# EAGLE design controller (EAGLE 4.16)
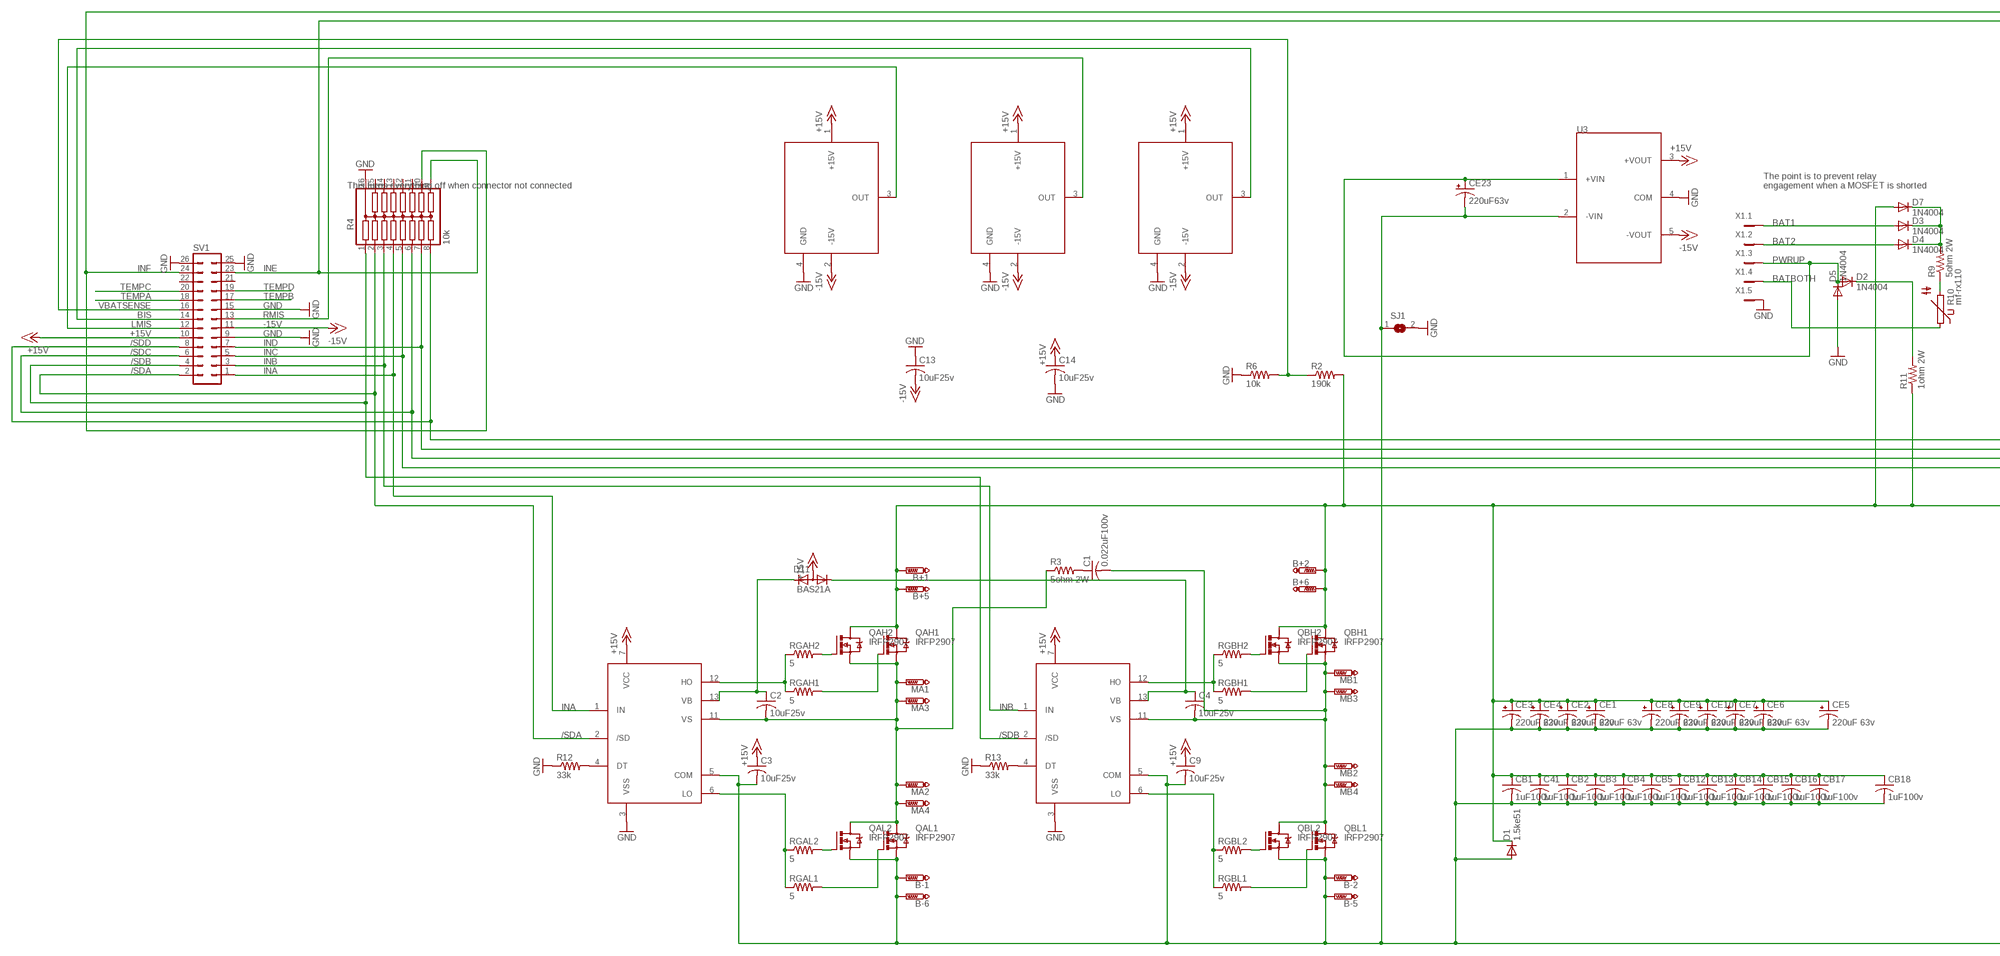
[diagram p0: schematic, sheet 1, part 1 of 3]
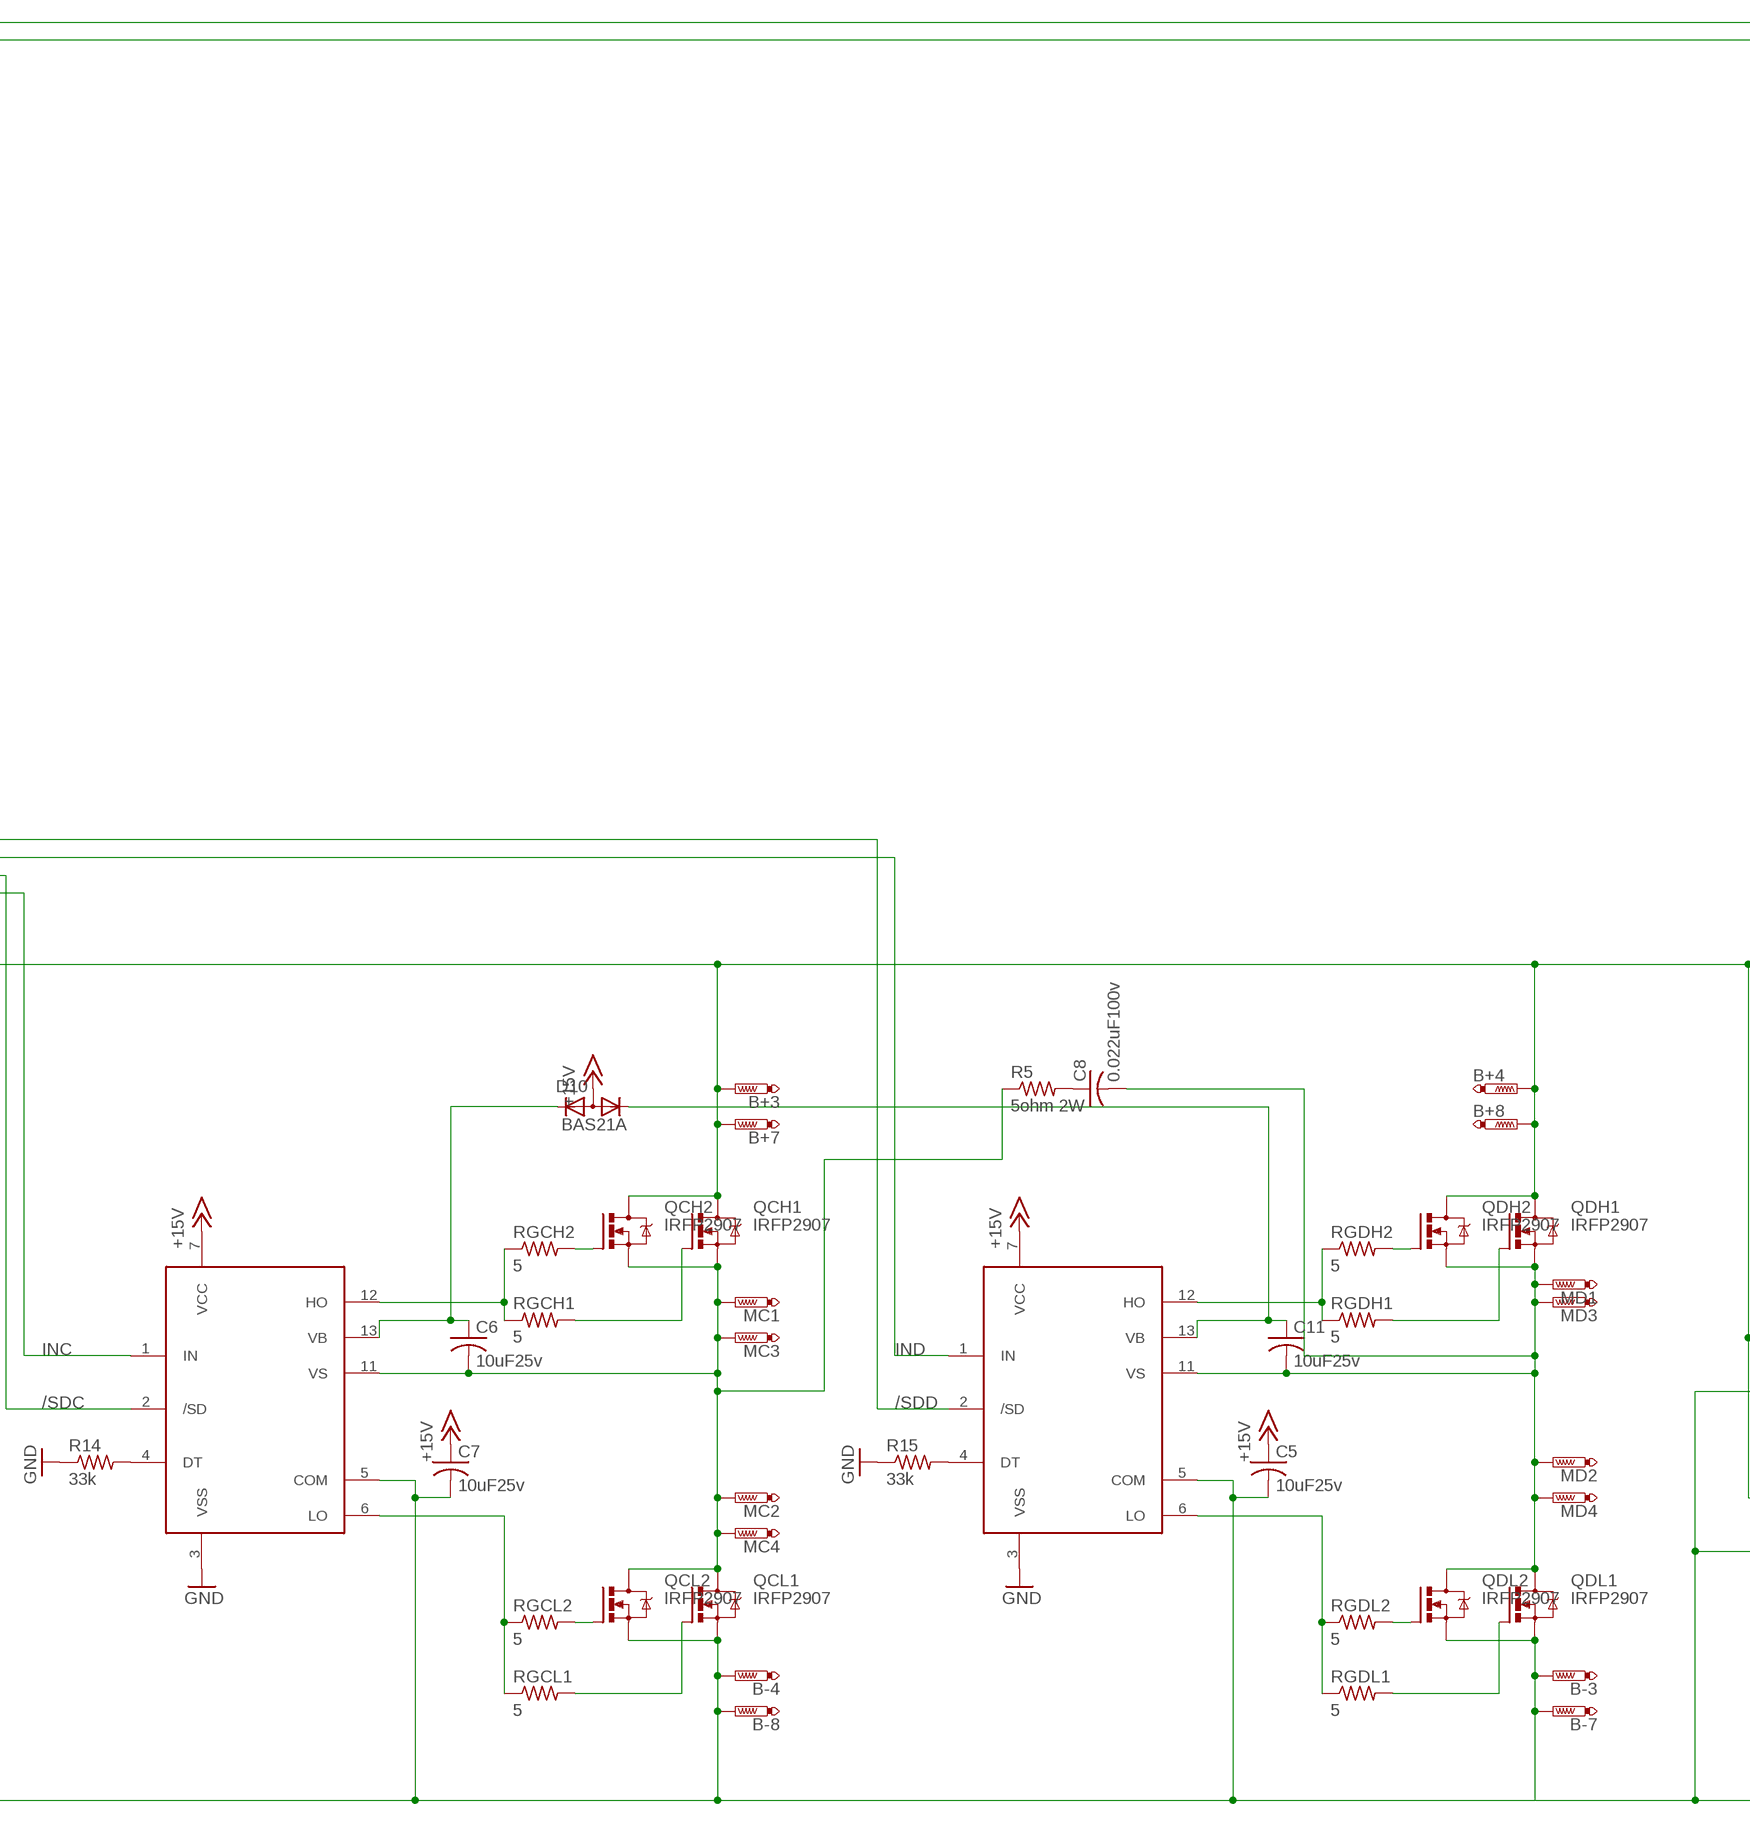
[diagram p1: schematic, sheet 1, part 2 of 3]
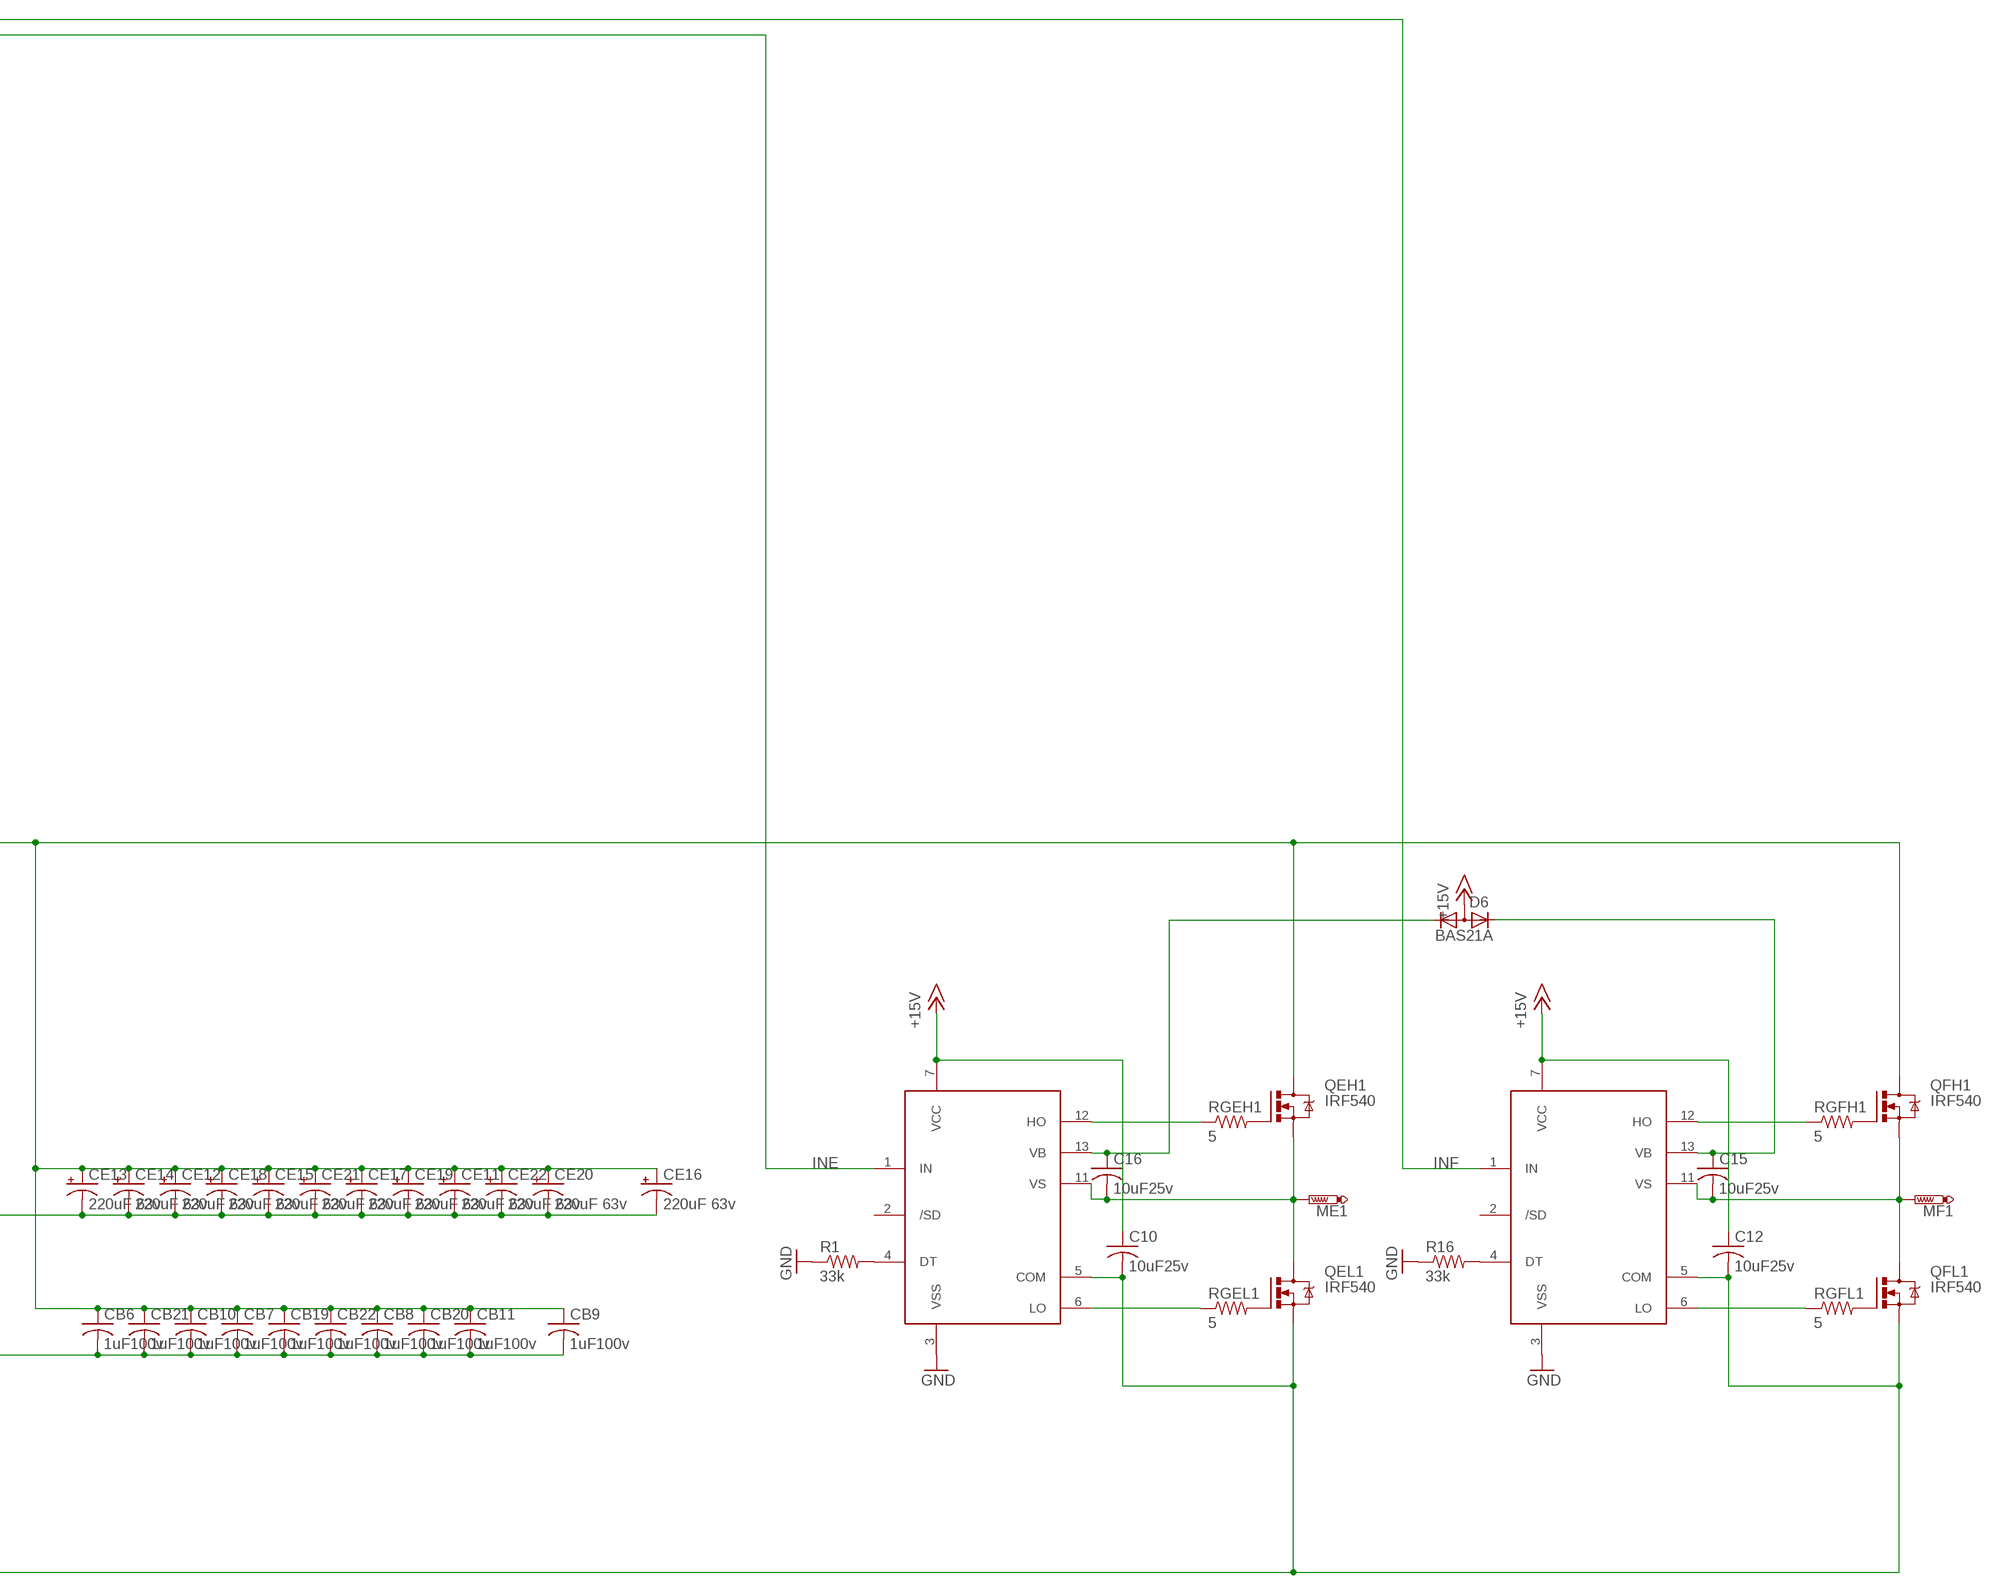
[diagram p2: schematic, sheet 1, part 3 of 3]

## Parts
B+1  PTR1PAD1-17Y  [P1-17Y]
B+2  PTR1PAD1-17Y  [P1-17Y]
B+3  PTR1PAD1-17Y  [P1-17Y]
B+4  PTR1PAD1-17Y  [P1-17Y]
B+5  PTR1PAD1-17Y  [P1-17Y]
B+6  PTR1PAD1-17Y  [P1-17Y]
B+7  PTR1PAD1-17Y  [P1-17Y]
B+8  PTR1PAD1-17Y  [P1-17Y]
B-1  PTR1PAD1-17Y  [P1-17Y]
B-2  PTR1PAD1-17Y  [P1-17Y]
B-3  PTR1PAD1-17Y  [P1-17Y]
B-4  PTR1PAD1-17Y  [P1-17Y]
B-5  PTR1PAD1-17Y  [P1-17Y]
B-6  PTR1PAD1-17Y  [P1-17Y]
B-7  PTR1PAD1-17Y  [P1-17Y]
B-8  PTR1PAD1-17Y  [P1-17Y]
BATIS  L08P150D15  [L08P]
C1  0.022uF100v  C-US102-043X133  [C102-043X133]
C2  10uF25v  C-USC1206  [C1206]
C3  10uF25v  C-USC1206  [C1206]
C4  10uF25v  C-USC1206  [C1206]
C5  10uF25v  C-USC1206  [C1206]
C6  10uF25v  C-USC1206  [C1206]
C7  10uF25v  C-USC1206  [C1206]
C8  0.022uF100v  C-US102-043X133  [C102-043X133]
C9  10uF25v  C-USC1206  [C1206]
C10  10uF25v  C-USC1206  [C1206]
C11  10uF25v  C-USC1206  [C1206]
C12  10uF25v  C-USC1206  [C1206]
C13  10uF25v  C-USC1206  [C1206]
C14  10uF25v  C-USC1206  [C1206]
C15  10uF25v  C-USC1206  [C1206]
C16  10uF25v  C-USC1206  [C1206]
C41  1uF100v  C-USC1812  [C1812]
CB1  1uF100v  C-USC1812  [C1812]
CB2  1uF100v  C-USC1812  [C1812]
CB3  1uF100v  C-USC1812  [C1812]
CB4  1uF100v  C-USC1812  [C1812]
CB5  1uF100v  C-USC1812  [C1812]
CB6  1uF100v  C-USC1812  [C1812]
CB7  1uF100v  C-USC1812  [C1812]
CB8  1uF100v  C-USC1812  [C1812]
CB9  1uF100v  C-USC1812  [C1812]
CB10  1uF100v  C-USC1812  [C1812]
CB11  1uF100v  C-USC1812  [C1812]
CB12  1uF100v  C-USC1812  [C1812]
CB13  1uF100v  C-USC1812  [C1812]
CB14  1uF100v  C-USC1812  [C1812]
CB15  1uF100v  C-USC1812  [C1812]
CB16  1uF100v  C-USC1812  [C1812]
CB17  1uF100v  C-USC1812  [C1812]
CB18  1uF100v  C-USC1812  [C1812]
CB19  1uF100v  C-USC1812  [C1812]
CB20  1uF100v  C-USC1812  [C1812]
CB21  1uF100v  C-USC1812  [C1812]
CB22  1uF100v  C-USC1812  [C1812]
CE1  220uF 63v  CPOL-USE5-10.5  [E5-10,5]
CE2  220uF 63v  CPOL-USE5-10.5  [E5-10,5]
CE3  220uF 63v  CPOL-USE5-10.5  [E5-10,5]
CE4  220uF 63v  CPOL-USE5-10.5  [E5-10,5]
CE5  220uF 63v  CPOL-USE5-10.5  [E5-10,5]
CE6  220uF 63v  CPOL-USE5-10.5  [E5-10,5]
CE7  220uF 63v  CPOL-USE5-10.5  [E5-10,5]
CE8  220uF 63v  CPOL-USE5-10.5  [E5-10,5]
CE9  220uF 63v  CPOL-USE5-10.5  [E5-10,5]
CE10  220uF 63v  CPOL-USE5-10.5  [E5-10,5]
CE11  220uF 63v  CPOL-USE5-10.5  [E5-10,5]
CE12  220uF 63v  CPOL-USE5-10.5  [E5-10,5]
CE13  220uF 63v  CPOL-USE5-10.5  [E5-10,5]
CE14  220uF 63v  CPOL-USE5-10.5  [E5-10,5]
CE15  220uF 63v  CPOL-USE5-10.5  [E5-10,5]
CE16  220uF 63v  CPOL-USE5-10.5  [E5-10,5]
CE17  220uF 63v  CPOL-USE5-10.5  [E5-10,5]
CE18  220uF 63v  CPOL-USE5-10.5  [E5-10,5]
CE19  220uF 63v  CPOL-USE5-10.5  [E5-10,5]
CE20  220uF 63v  CPOL-USE5-10.5  [E5-10,5]
CE21  220uF 63v  CPOL-USE5-10.5  [E5-10,5]
CE22  220uF 63v  CPOL-USE5-10.5  [E5-10,5]
CE23  220uF63v  CPOL-USE5-10.5  [E5-10,5]
D1  1.5ke51  DIODE-DO201-15  [DO201-15]
D2  1N4004  DIODE-DO41-10  [DO41-10]
D3  1N4004  DIODE-DO41-10  [DO41-10]
D4  1N4004  DIODE-DO41-10  [DO41-10]
D5  1N4004  DIODE-DO41-10  [DO41-10]
D6  BAS21A  DIODE-2CA|ACSOT23  [SOT23]
D7  1N4004  DIODE-DO41-10  [DO41-10]
D10  BAS21A  DIODE-2CA|ACSOT23  [SOT23]
D11  BAS21A  DIODE-2CA|ACSOT23  [SOT23]
DRV1  IR21844S  [14-SOIC]
DRV2  IR21844S  [14-SOIC]
DRV3  IR21844S  [14-SOIC]
DRV4  IR21844S  [14-SOIC]
DRV5  IR21844S  [14-SOIC]
DRV6  IR21844S  [14-SOIC]
LMIS  L08P150D15  [L08P]
MA1  PTR1PAD1-17Y  [P1-17Y]
MA2  PTR1PAD1-17Y  [P1-17Y]
MA3  PTR1PAD1-17Y  [P1-17Y]
MA4  PTR1PAD1-17Y  [P1-17Y]
MB1  PTR1PAD1-17Y  [P1-17Y]
MB2  PTR1PAD1-17Y  [P1-17Y]
MB3  PTR1PAD1-17Y  [P1-17Y]
MB4  PTR1PAD1-17Y  [P1-17Y]
MC1  PTR1PAD1-17Y  [P1-17Y]
MC2  PTR1PAD1-17Y  [P1-17Y]
MC3  PTR1PAD1-17Y  [P1-17Y]
MC4  PTR1PAD1-17Y  [P1-17Y]
MD1  PTR1PAD1-17Y  [P1-17Y]
MD2  PTR1PAD1-17Y  [P1-17Y]
MD3  PTR1PAD1-17Y  [P1-17Y]
MD4  PTR1PAD1-17Y  [P1-17Y]
ME1  PTR1PAD1-17Y  [P1-17Y]
MF1  PTR1PAD1-17Y  [P1-17Y]
QAH1  IRFP2907  IRFPC40  [TO247BV]
QAH2  IRFP2907  IRFPC40  [TO247BV]
QAL1  IRFP2907  IRFPC40  [TO247BV]
QAL2  IRFP2907  IRFPC40  [TO247BV]
QBH1  IRFP2907  IRFPC40  [TO247BV]
QBH2  IRFP2907  IRFPC40  [TO247BV]
QBL1  IRFP2907  IRFPC40  [TO247BV]
QBL2  IRFP2907  IRFPC40  [TO247BV]
QCH1  IRFP2907  IRFPC40  [TO247BV]
QCH2  IRFP2907  IRFPC40  [TO247BV]
QCL1  IRFP2907  IRFPC40  [TO247BV]
QCL2  IRFP2907  IRFPC40  [TO247BV]
QDH1  IRFP2907  IRFPC40  [TO247BV]
QDH2  IRFP2907  IRFPC40  [TO247BV]
QDL1  IRFP2907  IRFPC40  [TO247BV]
QDL2  IRFP2907  IRFPC40  [TO247BV]
QEH1  IRF540  [TO220BV]
QEL1  IRF540  [TO220BV]
QFH1  IRF540  [TO220BV]
QFL1  IRF540  [TO220BV]
R1  33k  R-US_R0805  [R0805]
R2  190k  R-US_R0805  [R0805]
R3  5ohm 2W  R-US_0414/15  [0414/15]
R4  10k  4816P-T02  [4816P]
R5  5ohm 2W  R-US_0414/15  [0414/15]
R6  10k  R-US_R0805  [R0805]
R9  5ohm 2W  R-US_0414/15  [0414/15]
R10  mf-rx110  S05K40  [S05K40]
R11  1ohm 2W  R-US_0414/15  [0414/15]
R12  33k  R-US_R0805  [R0805]
R13  33k  R-US_R0805  [R0805]
R14  33k  R-US_R0805  [R0805]
R15  33k  R-US_R0805  [R0805]
R16  33k  R-US_R0805  [R0805]
RGAH1  5  R-US_R0805  [R0805]
RGAH2  5  R-US_R0805  [R0805]
RGAL1  5  R-US_R0805  [R0805]
RGAL2  5  R-US_R0805  [R0805]
RGBH1  5  R-US_R0805  [R0805]
RGBH2  5  R-US_R0805  [R0805]
RGBL1  5  R-US_R0805  [R0805]
RGBL2  5  R-US_R0805  [R0805]
RGCH1  5  R-US_R0805  [R0805]
RGCH2  5  R-US_R0805  [R0805]
RGCL1  5  R-US_R0805  [R0805]
RGCL2  5  R-US_R0805  [R0805]
RGDH1  5  R-US_R0805  [R0805]
RGDH2  5  R-US_R0805  [R0805]
RGDL1  5  R-US_R0805  [R0805]
RGDL2  5  R-US_R0805  [R0805]
RGEH1  5  R-US_R0805  [R0805]
RGEL1  5  R-US_R0805  [R0805]
RGFH1  5  R-US_R0805  [R0805]
RGFL1  5  R-US_R0805  [R0805]
RMIS  L08P150D15  [L08P]
SJ1  SJ  [SJ]
SV1  MA13-2  [MA13-2]
U3  DFC10U48D15  [DFC10]
X1  MC5  [MC5]

## Nets
+15V [pwr]: BATIS.1(+15V) C3.1 C5.1 C7.1 C9.1 C10.1 C12.1 C14.1 D6.3(A) D10.3(A) D11.3(A) DRV1.7(VCC) DRV2.7(VCC) DRV3.7(VCC) DRV4.7(VCC) DRV5.7(VCC) DRV6.7(VCC) LMIS.1(+15V) RMIS.1(+15V) SV1.10 U3.3(+VOUT)
-15V [pwr]: BATIS.2(-15V) C13.2 LMIS.2(-15V) RMIS.2(-15V) SV1.11 U3.5(-VOUT)
/SDA: DRV1.2(/SD) R4.2 SV1.2
/SDB: DRV2.2(/SD) R4.1 SV1.4
/SDC: DRV3.2(/SD) R4.6 SV1.6
/SDD: DRV4.2(/SD) R4.8 SV1.8
B+ [highpwr]: B+1.1(TP) B+2.1(TP) B+3.1(TP) B+4.1(TP) B+5.1(TP) B+6.1(TP) B+7.1(TP) B+8.1(TP) C41.1 CB1.1 CB2.1 CB3.1 CB4.1 CB5.1 CB6.1 CB7.1 CB8.1 CB9.1 CB10.1 CB11.1 CB12.1 CB13.1 CB14.1 CB15.1 CB16.1 CB17.1 CB18.1 CB19.1 CB20.1 CB21.1 CB22.1 CE1.+ CE2.+ CE3.+ CE4.+ CE5.+ CE6.+ CE7.+ CE8.+ CE9.+ CE10.+ CE11.+ CE12.+ CE13.+ CE14.+ CE15.+ CE16.+ CE17.+ CE18.+ CE19.+ CE20.+ CE21.+ CE22.+ D1.C D7.A QAH1.D QAH2.D QBH1.D QBH2.D QCH1.D QCH2.D QDH1.D QDH2.D QEH1.D QFH1.D R2.2 R11.1
B- [highpwr]: B-1.1(TP) B-2.1(TP) B-3.1(TP) B-4.1(TP) B-5.1(TP) B-6.1(TP) B-7.1(TP) B-8.1(TP) C3.2 C5.2 C7.2 C9.2 C10.2 C12.2 C41.2 CB1.2 CB2.2 CB3.2 CB4.2 CB5.2 CB6.2 CB7.2 CB8.2 CB9.2 CB10.2 CB11.2 CB12.2 CB13.2 CB14.2 CB15.2 CB16.2 CB17.2 CB18.2 CB19.2 CB20.2 CB21.2 CB22.2 CE1.- CE2.- CE3.- CE4.- CE5.- CE6.- CE7.- CE8.- CE9.- CE10.- CE11.- CE12.- CE13.- CE14.- CE15.- CE16.- CE17.- CE18.- CE19.- CE20.- CE21.- CE22.- CE23.- D1.A DRV1.5(COM) DRV2.5(COM) DRV3.5(COM) DRV4.5(COM) DRV5.5(COM) DRV6.5(COM) QAL1.S QAL2.S QBL1.S QBL2.S QCL1.S QCL2.S QDL1.S QDL2.S QEL1.S QFL1.S SJ1.1 U3.2(-VIN)
BAT1 [highsig]: D3.A X1.1
BAT2 [highsig]: D4.A X1.2
BATBOTH: R10.1 X1.4
BIS: BATIS.3(OUT) SV1.14
GAH [highsig]: DRV1.12(HO) RGAH1.1 RGAH2.1
GAH1 [highsig]: DRV3.12(HO) RGCH1.1 RGCH2.1
GAL [highsig]: DRV1.6(LO) RGAL1.1 RGAL2.1
GAL1 [highsig]: DRV3.6(LO) RGCL1.1 RGCL2.1
GBH [highsig]: DRV2.12(HO) RGBH1.1 RGBH2.1
GBH1 [highsig]: DRV4.12(HO) RGDH1.1 RGDH2.1
GBL [highsig]: DRV2.6(LO) RGBL1.1 RGBL2.1
GBL1 [highsig]: DRV4.6(LO) RGDL1.1 RGDL2.1
GND [pwr]: BATIS.4(GND) C13.1 C14.2 D5.A DRV1.3(VSS) DRV2.3(VSS) DRV3.3(VSS) DRV4.3(VSS) DRV5.3(VSS) DRV6.3(VSS) LMIS.4(GND) R1.1 R4.16 R6.1 R12.1 R13.1 R14.1 R15.1 R16.1 RMIS.4(GND) SJ1.2 SV1.9 SV1.15 SV1.25 SV1.26 U3.4(COM) X1.5
INA: DRV1.1(IN) R4.4 SV1.1
INB: DRV2.1(IN) R4.3 SV1.3
INC: DRV3.1(IN) R4.5 SV1.5
IND: DRV4.1(IN) R4.7 SV1.7
INE: DRV5.1(IN) R4.9 SV1.23
INF: DRV6.1(IN) R4.10 SV1.24
LMIS: RMIS.3(OUT) SV1.12
MA1 [highpwr]: C6.2 DRV3.11(VS) MC1.1(TP) MC2.1(TP) MC3.1(TP) MC4.1(TP) QCH1.S QCH2.S QCL1.D QCL2.D R5.1
MA2 [highpwr]: C2.2 DRV1.11(VS) MA1.1(TP) MA2.1(TP) MA3.1(TP) MA4.1(TP) QAH1.S QAH2.S QAL1.D QAL2.D R3.1
MB1 [highpwr]: C8.2 C11.2 DRV4.11(VS) MD1.1(TP) MD2.1(TP) MD3.1(TP) MD4.1(TP) QDH1.S QDH2.S QDL1.D QDL2.D
MB2 [highpwr]: C1.2 C4.2 DRV2.11(VS) MB1.1(TP) MB2.1(TP) MB3.1(TP) MB4.1(TP) QBH1.S QBH2.S QBL1.D QBL2.D
ME: C16.2 DRV5.11(VS) ME1.1(TP) QEH1.S QEL1.D
MF: C15.2 DRV6.11(VS) MF1.1(TP) QFH1.S QFL1.D
N$1 [highpwr]: D2.C R11.2
N$2 [highpwr]: C1.1 R3.2
N$3: DRV1.4(DT) R12.2
N$4: C8.1 R5.2
N$5: DRV3.4(DT) R14.2
N$6: DRV4.4(DT) R15.2
N$7 [highsig]: R9.1 R10.2
N$8 [highsig]: D3.C D4.C D7.C R9.2
N$9: DRV2.4(DT) R13.2
N$10: QEH1.G RGEH1.2
N$11: QEL1.G RGEL1.2
N$12: DRV5.6(LO) RGEL1.1
N$13: QFH1.G RGFH1.2
N$15: DRV6.6(LO) RGFL1.1
N$16: DRV5.12(HO) RGEH1.1
N$17: C16.1 D6.1(K1) DRV5.13(VB)
N$20: QFL1.G RGFL1.2
N$21: DRV6.12(HO) RGFH1.1
N$22: C15.1 D6.2(K2) DRV6.13(VB)
N$24: DRV5.4(DT) R1.2
N$25: DRV6.4(DT) R16.2
PWRUP: CE23.+ D2.A D5.C U3.1(+VIN) X1.3
Q1G [highsig]: QAH1.G RGAH1.2
Q1G1 [highsig]: QCH1.G RGCH1.2
Q2G [highsig]: QAH2.G RGAH2.2
Q2G1 [highsig]: QCH2.G RGCH2.2
Q3G [highsig]: QAL1.G RGAL1.2
Q3G1 [highsig]: QCL1.G RGCL1.2
Q4G [highsig]: QAL2.G RGAL2.2
Q4G1 [highsig]: QCL2.G RGCL2.2
Q5G [highsig]: QBH1.G RGBH1.2
Q5G1 [highsig]: QDH1.G RGDH1.2
Q6G [highsig]: QBH2.G RGBH2.2
Q6G1 [highsig]: QDH2.G RGDH2.2
Q7G [highsig]: QBL1.G RGBL1.2
Q7G1 [highsig]: QDL1.G RGDL1.2
Q8G [highsig]: QBL2.G RGBL2.2
Q8G1 [highsig]: QDL2.G RGDL2.2
RMIS: LMIS.3(OUT) SV1.13
TEMPA: SV1.18
TEMPB: SV1.17
TEMPC: SV1.20
TEMPD: SV1.19
VB1 [pwr]: C2.1 D11.2(K2) DRV1.13(VB)
VB2 [pwr]: C4.1 D11.1(K1) DRV2.13(VB)
VB3 [pwr]: C6.1 D10.2(K2) DRV3.13(VB)
VB4 [pwr]: C11.1 D10.1(K1) DRV4.13(VB)
VBATSENSE: R2.1 R6.2 SV1.16
Unconnected: DRV5.2(/SD) DRV6.2(/SD) R4.11 R4.12 R4.13 R4.14 R4.15 SV1.21 SV1.22

## Notes on the sheet
- The point is to prevent relay
- This turns everything off when connector not connected | engagement when a MOSFET is shorted

## Library data of the parts
B+1-B+8 B-1-B-8 MA1-MA4 MB1-MB4 MC1-MC4 MD1-MD4 ME1 MF1 = testpad:PTR1: TEST PIN
BATIS LMIS RMIS = tlb:L08P150D15
C1-C16 C41 CB1-CB22 = rcl:C-US: CAPACITOR, American symbol
CE1-CE23 = rcl:CPOL-US: POLARIZED CAPACITOR, American symbol
D1-D5 D7 = diode:DIODE-: DIODE
D6 D10 D11 = diode:DIODE-2CA|AC: Dual DIODE Cathode-Anode|Anode-Cathode
DRV1-DRV6 = tlb:IR21844S
QAH1 QAH2 QAL1 QAL2 QBH1 QBH2 QBL1 QBL2 QCH1 QCH2 QCL1 QCL2 QDH1 QDH2 QDL1 QDL2 = transistor-power:IRFPC40: N-CHANNEL MOS FET
QEH1 QEL1 QFH1 QFL1 = transistor-power:IRF540: HEXFET Power MOSFET
R1-R3 R5 R6 R9 R11-R16 RGAH1 RGAH2 RGAL1 RGAL2 RGBH1 RGBH2 RGBL1 RGBL2 RGCH1 RGCH2 RGCL1 RGCL2 RGDH1 RGDH2 RGDL1 RGDL2 RGEH1 RGEL1 RGFH1 RGFL1 = rcl:R-US_: RESISTOR, American symbol
R4 = resistor-bourns:4816P-T02: BOURNS RESISTOR NETWORK
R10 = varistor:S05K40: VARISTOR
SJ1 = jumper:SJ: SMD solder JUMPER
SV1 = con-lstb:MA13-2: PIN HEADER
U3 = tlb:DFC10U48D15
X1 = con-phoenix-381_l:MC5: Mini-Combicon 3.81mm horizontal 5-polig (ohne Gegenstecker)

## Net classes
0 default: width 0.254 mm
1 highpwr: width 0.61 mm, clearance 0.813 mm
2 highsig: width 0.406 mm, clearance 0.61 mm
3 pwr: width 0.254 mm, clearance 0.61 mm

## Board
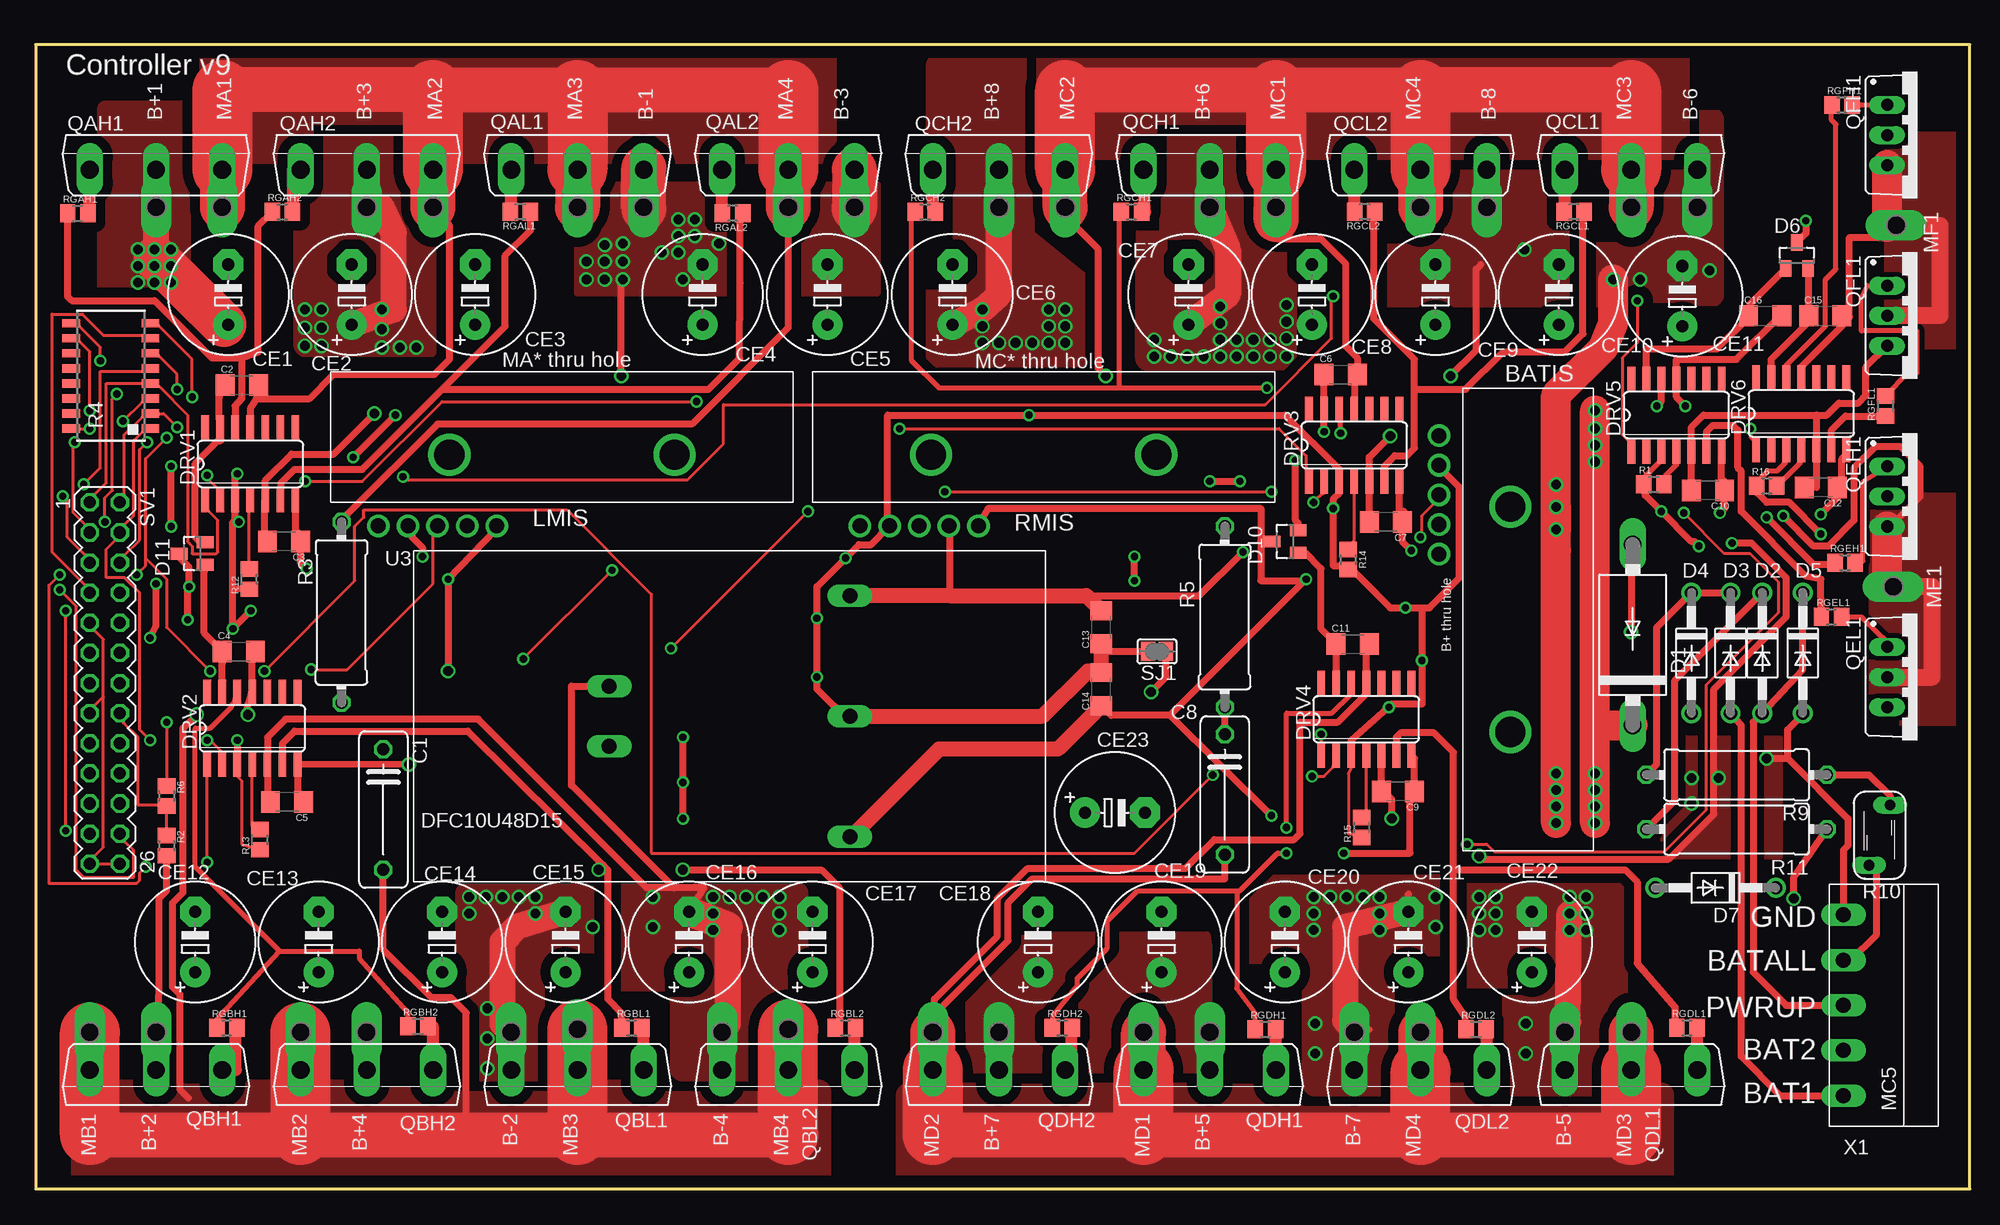
[diagram p3: board, top side]
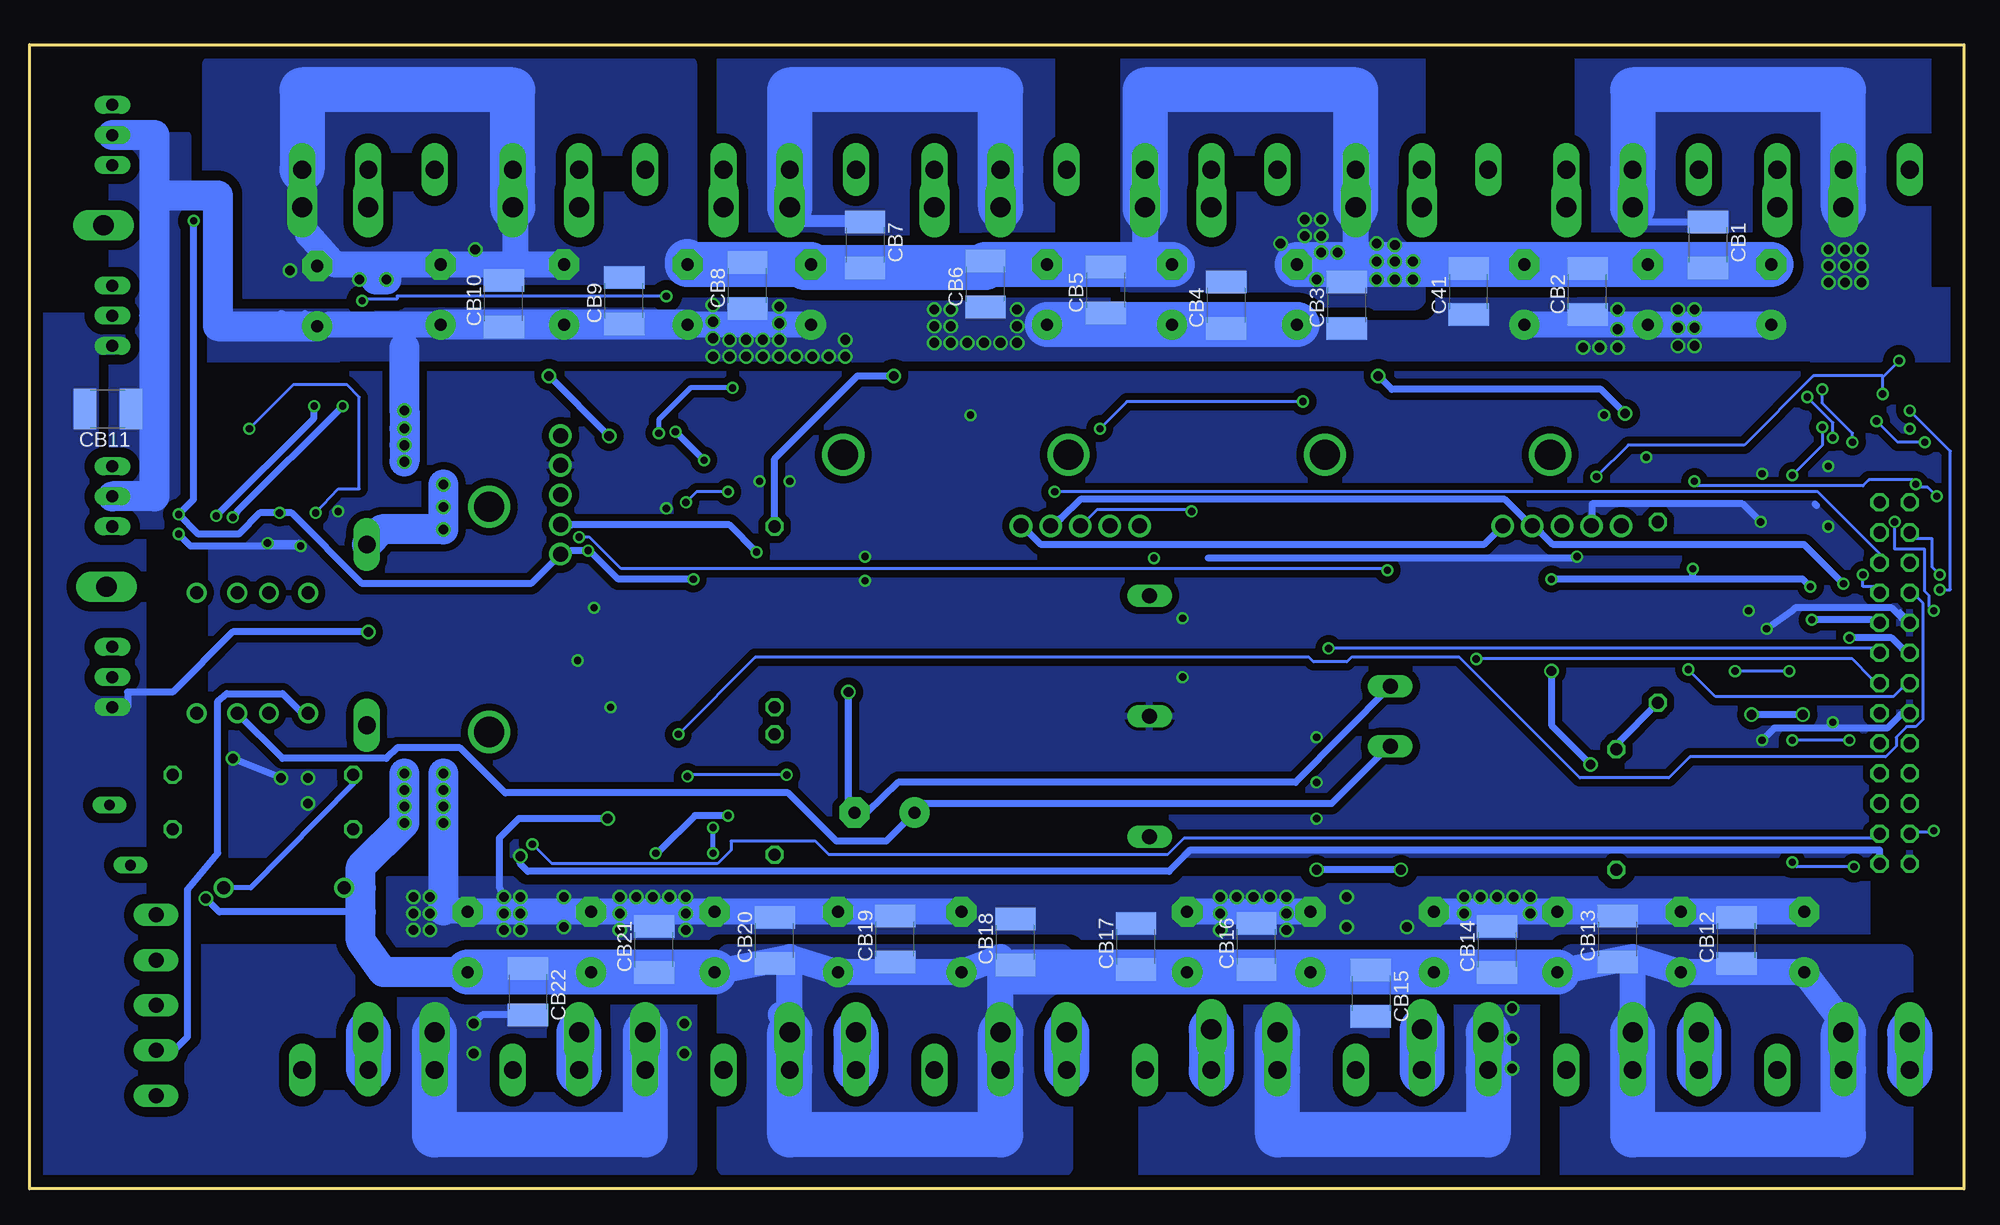
[diagram p4: board, bottom side, seen from below]

Size 163.2 x 96.52 mm. Coordinates in mm from the lower left corner, seen from the top.
Outline: 0,0 163.2,0 163.2,96.52 0,96.52 0,0
Copper layers (1*16): Top 0.035mm / dielectric 1.5mm / Bottom 0.035mm
Design rules "default": minimum track width 7mil, minimum drill 24mil, track to track 8mil, track to pad 8mil, pad to pad 8mil, via to via 8mil, smd to smd 8mil, copper to edge 40mil, drill to drill 8mil, minimum pad ring 10mil, minimum via ring 8mil, stop-mask expansion 4mil, vias tented up to drill 0mil, thermal gap 10mil

### Footprints (pad centres in the part's own frame; a part is rotated, then mirrored left to right if it is on the bottom)
P1-17Y = drill 1.702 pad 2.121 long: 1 0,0
L08P = drill 1.27 round: 1 -3,-3; 2 -5.5,-3; 3 -8,-3; 4 -10.5,-3; 5 -13,-3 | drill 2.54 round: P$6 -7,3; P$7 12,3
C102-043X133 = drill 1.016 octagon: 1 -5.08,0; 2 5.08,0
C1206 = smd 1.6 x 1.8: 1 -1.4,0; 2 1.4,0
C1812 = smd 1.9 x 3.4: 1 -1.95,0; 2 1.95,0
E5-10,5 = drill 1.016 pad 2.54 round: + -2.54,0 | drill 1.016 pad 2.54 octagon: - 2.54,0
DO201-15 = drill 1.499 long: A 7.62,0; C -7.62,0
DO41-10 = drill 1.118 round: A 5.08,0; C -5.08,0
SOT23 = smd 1 x 1.4: 1 -0.95,-1.1; 2 0.95,-1.1; 3 0,1.1
14-SOIC = smd 0.66 x 2.032: 1 -3.81,-3.073; 2 -2.54,-3.073; 3 -1.27,-3.073; 4 0,-3.073; 5 1.27,-3.073; 6 2.54,-3.073; 7 3.81,-3.073; 8 3.81,3.073; 9 2.54,3.073; 10 1.27,3.073; 11 0,3.073; 12 -1.27,3.073; 13 -2.54,3.073; 14 -3.81,3.073
TO247BV = drill 1.499 long: D 0,-2.921; G -5.588,-2.921; S 5.588,-2.921
TO220BV = drill 1.016 long: D 0,-2.54; G -2.54,-2.54; S 2.54,-2.54
R0805 = smd 1.3 x 1.5: 1 -0.85,0; 2 0.85,0
0414/15 = drill 1.016 octagon: 1 -7.62,0; 2 7.62,0
4816P = smd 0.7 x 1.5: 1 -4.445,-3.346; 2 -3.175,-3.346; 3 -1.905,-3.346; 4 -0.635,-3.346; 5 0.635,-3.346; 6 1.905,-3.346; 7 3.175,-3.346; 8 4.445,-3.346; 9 4.445,3.346; 10 3.175,3.346; 11 1.905,3.346; 12 0.635,3.346; 13 -0.635,3.346; 14 -1.905,3.346; 15 -3.175,3.346; 16 -4.445,3.346
S05K40 = drill 0.914 long: 1 -0.889,-2.54; 2 0.889,2.54
SJ = smd 1.168 x 1.6: 1 -0.762,0; 2 0.762,0
MA13-2 = drill 1.016 octagon: 1 -15.24,-1.27; 2 -15.24,1.27; 3 -12.7,-1.27; 4 -12.7,1.27; 5 -10.16,-1.27; 6 -10.16,1.27; 7 -7.62,-1.27; 8 -7.62,1.27; 9 -5.08,-1.27; 10 -5.08,1.27; 11 -2.54,-1.27; 12 -2.54,1.27; 13 0,-1.27; 14 0,1.27; 15 2.54,-1.27; 16 2.54,1.27; 17 5.08,-1.27; 18 5.08,1.27; 19 7.62,-1.27; 20 7.62,1.27; 21 10.16,-1.27; 22 10.16,1.27; 23 12.7,-1.27; 24 12.7,1.27; 25 15.24,-1.27; 26 15.24,1.27
DFC10 = drill 1.27 long: 1 0,-2.54; 2 0,2.54; 3 20.32,-10.16; 4 20.32,0; 5 20.32,10.16
MC5 = drill 1.27 long: 1 -7.62,0; 2 -3.81,0; 3 0,0; 4 3.81,0; 5 7.62,0

### Placement (x,y rotation side)
B+1  10.16,82.8 180 top
B+2  10.16,13.21 0 top
B+3  27.94,82.8 180 top
B+4  27.94,13.21 0 top
B+5  99.06,13.21 0 top
B+6  99.06,82.8 180 top
B+7  81.28,13.21 0 top
B+8  81.28,82.8 180 top
B-1  51.31,82.8 180 top
B-2  40.13,13.21 0 top
B-3  69.09,82.8 180 top
B-4  57.91,13.21 0 top
B-5  129.03,13.21 0 top
B-6  140.21,82.8 180 top
B-7  111.25,13.21 0 top
B-8  122.43,82.8 180 top
BATIS  121.41,50.55 270 top
C1  29.34,32 270 top
C2  17.4,67.82 0 top
C3  20.95,54.61 180 top
C4  17.14,45.34 0 top
C5  21.21,32.64 180 top
C6  110.11,68.71 0 top
C7  113.92,56.26 180 top
C8  100.33,33.27 270 top
C9  114.94,33.53 180 top
C10  141.1,58.93 180 top
C11  111.12,45.97 0 top
C12  150.62,59.18 180 top
C13  89.92,47.37 90 top
C14  89.92,42.16 90 top
C15  151,73.66 0 top
C16  145.92,73.66 0 top
C41  41.78,75.69 90 bottom
CB1  21.59,79.63 270 bottom
CB2  31.75,75.69 90 bottom
CB3  52.07,74.55 90 bottom
CB4  62.23,74.55 90 bottom
CB5  72.39,75.82 90 bottom
CB6  82.55,76.33 90 bottom
CB7  92.71,79.63 270 bottom
CB8  102.62,76.2 90 bottom
CB9  113.03,74.93 90 bottom
CB10  123.19,74.68 90 bottom
CB11  156.59,65.79 180 bottom
CB12  19.18,20.95 90 bottom
CB13  29.21,21.08 90 bottom
CB14  39.37,20.19 90 bottom
CB15  50.04,16.51 270 bottom
CB16  59.69,20.45 90 bottom
CB17  69.85,20.45 90 bottom
CB18  80.01,20.83 90 bottom
CB19  90.17,21.08 90 bottom
CB20  100.33,20.95 90 bottom
CB21  110.49,20.19 90 bottom
CB22  121.16,16.64 270 bottom
CE1  16.26,75.44 90 top
CE2  26.67,75.44 90 top
CE3  37.08,75.44 90 top
CE4  56.26,75.44 90 top
CE5  66.8,75.44 90 top
CE6  77.34,75.44 90 top
CE7  97.28,75.44 90 top
CE8  107.7,75.44 90 top
CE9  118.11,75.44 90 top
CE10  128.52,75.44 90 top
CE11  138.94,75.31 90 top
CE12  13.46,20.83 90 top
CE13  23.88,20.83 90 top
CE14  34.29,20.83 90 top
CE15  44.7,20.83 90 top
CE16  55.12,20.83 90 top
CE17  65.53,20.83 90 top
CE18  84.58,20.83 90 top
CE19  95,20.83 90 top
CE20  105.41,20.83 90 top
CE21  115.82,20.83 90 top
CE22  126.24,20.83 90 top
CE23  91.06,31.75 0 top
D1  134.75,46.74 90 top
D2  145.67,45.21 270 top
D3  143,45.21 270 top
D4  139.7,45.21 270 top
D5  149.1,45.21 270 top
D6  148.59,78.74 0 top
D7  141.73,25.4 180 top
D10  105.41,54.61 90 top
D11  13.21,53.59 90 top
DRV1  18.11,61.16 0 top
DRV2  18.29,38.86 0 top
DRV3  111.25,62.74 0 top
DRV4  112.27,39.62 0 top
DRV5  138.43,65.28 0 top
DRV6  148.97,65.41 0 top
LMIS  41.91,58.93 0 top
MA1  15.75,82.8 180 top
MA2  33.53,82.8 180 top
MA3  45.72,82.8 180 top
MA4  63.5,82.8 180 top
MB1  4.57,13.21 0 top
MB2  22.35,13.21 0 top
MB3  45.72,13.46 0 top
MB4  63.5,13.46 0 top
MC1  104.65,82.8 180 top
MC2  86.87,82.8 180 top
MC3  134.62,82.8 180 top
MC4  116.84,82.8 180 top
MD1  93.47,13.21 0 top
MD2  75.69,13.21 0 top
MD3  134.62,13.21 0 top
MD4  116.84,13.21 0 top
ME1  156.72,50.8 90 top
MF1  156.97,81.28 270 top
QAH1  10.16,88.9 0 top
QAH2  27.94,88.9 0 top
QAL1  45.72,88.9 0 top
QAL2  63.5,88.9 0 top
QBH1  10.16,7.11 180 top
QBH2  27.94,7.11 180 top
QBL1  45.72,7.11 180 top
QBL2  63.5,7.11 180 top
QCH1  99.06,88.9 0 top
QCH2  81.28,88.9 0 top
QCL1  134.62,88.9 0 top
QCL2  116.84,88.9 0 top
QDH1  99.06,7.11 180 top
QDH2  81.28,7.11 180 top
QDL1  134.62,7.11 180 top
QDL2  116.84,7.11 180 top
QEH1  158.75,58.42 270 top
QEL1  158.75,43.18 270 top
QFH1  158.75,88.9 270 top
QFL1  158.75,73.66 270 top
R1  136.53,59.44 0 top
R2  11.05,28.96 270 top
R3  25.8,48.64 270 top
R4  6.35,68.58 90 top
R5  100.33,48.26 270 top
R6  11.05,33.15 270 top
R9  143.51,34.93 180 top
R10  155.58,29.84 0 top
R11  143.51,30.35 180 top
R12  18.03,51.44 90 top
R13  18.92,29.46 90 top
R14  110.74,53.09 90 top
R15  111.89,30.48 90 top
R16  146.05,59.31 0 top
RGAH1  3.56,82.3 0 top
RGAH2  20.83,82.42 0 top
RGAL1  40.89,82.42 180 top
RGAL2  58.8,82.3 180 top
RGBH1  16.13,13.59 0 top
RGBH2  32.26,13.72 0 top
RGBL1  50.29,13.59 0 top
RGBL2  68.33,13.59 0 top
RGCH1  92.46,82.42 0 top
RGCH2  75.06,82.42 0 top
RGCL1  129.79,82.42 180 top
RGCL2  112.14,82.42 180 top
RGDH1  103.76,13.46 0 top
RGDH2  86.61,13.59 0 top
RGDL1  139.32,13.59 0 top
RGDL2  121.54,13.46 0 top
RGEH1  152.65,52.83 0 top
RGEL1  151.51,48.26 0 top
RGFH1  152.4,91.44 0 top
RGFL1  156.08,66.04 90 top
RMIS  82.55,58.93 0 top
SJ1  94.61,45.34 180 top
SV1  5.84,42.67 270 top
U3  48.39,39.88 0 top
X1  152.53,15.49 90 top

### Tracks (layer width: path | path; a pad name or v marks a point on that pad's centre or on a via)
+15V  (via drill 0.61, 0.81)
  Top 0.61: v12.83,48.01 12.83,50.42 v12.95,50.8 12.95,52.45 | LMIS.1 38.86,55.63 v34.8,51.44 v34.8,43.69 | 107.06,51.31 95.69,39.94 | 103.38,54.61 103.38,57.4 80.39,57.4 RMIS.1 | 103.38,54.61 103.38,51.31 107.06,51.31 | 95.69,39.94 v104.27,31.5 | 12.95,52.45 12.89,52.51 | 107.06,51.31 v107.19,51.44 | 22.86,52.45 v22.86,52.32 22.35,52.83 22.35,55.12 | v110.36,28.32 115.95,28.32 115.95,33.4 C9.1 116.33,33.79 116.33,36.3 DRV4.7 | DRV3.7 115.06,57.15 115.45,57.15 C7.1 115.32,54.61 v116.08,53.85 | 22.35,55.12 C3.1 | DRV1.7 21.92,55.55 22.35,55.12 | C5.1 22.61,33.02 22.1,33.53 DRV2.7 22.2,35.79 v31.5,35.81 | DRV5.7 142.24,59.94 142.49,59.69 C10.1 142.5,57.41 v142.11,57.02 | 95.69,39.94 90.74,39.94 C14.1 | DRV6.7 152.78,61.98 152.4,61.6 152.4,59.18 151.77,58.93 C12.1 152.02,58.29 v150.62,56.9 | 103.38,54.61 D10.3 | D11.3 12.11,53.3 12.95,52.45 | D6.3 149.35,80.6 v149.35,81.66
  Top 1.27: 68.71,29.59 68.58,29.46 | 68.71,29.59 U3.3 | 68.71,29.59 76.21,37.1 86.25,37.1 C14.1
  Bottom 0.254: SV1.10 7.62,47.75 7.75,48.01
  Bottom 0.61: 7.75,48.01 v12.83,48.01 | v12.95,50.8 13.59,51.44 22.86,51.44 | 22.86,51.44 v34.8,51.44 | BATIS.1 117.47,53.85 v116.08,53.85 115.7,53.59 113.54,51.44 v107.19,51.44 | v104.27,31.5 107.06,31.5 109.98,28.57 v110.36,28.32 | LMIS.1 39.37,55.5 40.51,54.36 77.85,54.36 78.87,55.37 RMIS.1 | 22.86,51.44 v22.86,52.32 | v31.5,35.81 34.8,39.12 v34.8,43.69 | v149.35,81.66 149.35,58.17 v150.62,56.9 148.97,55.25 145.54,55.25 143.76,57.02 v142.11,57.02 141.1,57.02 135.13,51.05 120.9,51.05 BATIS.1 | BATIS.1 118.36,53.59
-15V  (via drill 0.61)
  Top 0.61: v9.65,46.48 10.16,47.5 v10.16,51.05 | RMIS.2 77.09,55.88 77.09,50.04 | v101.85,53.72 98.17,50.04 88.65,50.04
  Top 1.27: U3.5 77.09,50.04 88.65,50.04 C13.2
  Bottom 0.254: SV1.11 5.08,45.34 5.21,45.59
  Bottom 0.61: 5.21,45.59 6.1,46.48 v9.65,46.48 | v10.16,51.05 13.46,54.36 34.67,54.36 35.69,55.37 LMIS.2 37.08,56.52 38.74,58.17 74.55,58.17 76.2,56.52 76.33,56.52 RMIS.2 | v101.85,53.72 104.14,56.01 117.47,56.01 BATIS.2
/SDA  (via drill 0.61)
  Top 0.254: SV1.2 7.49,58.55 7.49,63.63 9.02,65.15 R4.2 10.79,65.41 v11.94,64.26 | v14.48,60.2 14.48,59.94 15.37,59.05 DRV1.2
  Bottom 0.254: v14.48,60.2 11.94,62.74 v11.94,64.26
/SDB  (via drill 0.61)
  Top 0.254: v14.48,37.85 14.73,37.85 15.75,36.83 DRV2.2 | v9.65,37.85 8.76,38.74 8.76,50.29 7.49,51.56 5.97,51.56 5.97,53.98 6.73,54.74 SV1.4 7.49,56.01 8.26,56.77 8.26,63.12 9.02,63.88 R4.1
  Bottom 0.254: v9.65,37.85 v14.48,37.85
/SDC  (via drill 0.61)
  Top 0.254: v107.82,57.91 107.82,58.04 108.71,58.67 DRV3.2 | v76.71,58.8 v104.27,58.8 | v11.94,67.44 11.94,68.71 10.41,70.23 R4.6 | v9.4,62.99 8.76,62.36 8.76,54.74 7.49,53.47 SV1.6
  Bottom 0.254: v104.27,58.8 106.93,58.8 v107.82,57.91 | v76.71,58.8 12.32,58.8 7.05,53.53 | 7.05,53.53 6.98,53.47 | SV1.6 7.11,53.47 7.05,53.53 | v11.94,67.44 11.94,66.29 9.4,63.75 v9.4,62.99
/SDD  (via drill 0.61)
  Top 0.254: v13.21,66.8 13.21,69.98 10.41,72.77 R4.8 | v11.05,63.37 9.27,61.6 9.27,53.21 | 9.27,53.21 9.27,52.58 v8.51,51.82 | v107.7,34.8 108.71,34.8 109.47,35.56 DRV4.2 | v99.31,34.93 92.71,28.32 51.94,28.32 51.94,50.17 44.83,57.28 27.69,57.28 27.69,56.64 26.92,55.88 26.92,51.31 v19.3,43.69 | v14.73,43.69 11.05,47.37 11.05,51.44 9.27,53.21
  Bottom 0.254: v13.21,66.8 11.05,64.64 v11.05,63.37 | v8.51,51.82 8.51,50.8 7.62,50.8 SV1.8 | v107.7,34.8 107.57,34.93 v99.31,34.93 | v14.73,43.69 v19.3,43.69
B+  (via drill 0.81)
  Top 0.61: R2.2 11.05,25.15 10.41,24.51 10.41,16.64 B+2.1 | v148.34,24.51 148.34,26.29 R11.1
  Top 2.184: B+6.1 100.58,79.25 100.58,75.44 CE7.+ | B+8.1 81.28,75.44 v79.88,74.17 CE6.+ | B+3.1 29.21,82.8 30.23,80.64 30.23,74.17 CE2.+ | 10.16,78.49 B+1.1 | CE1.+ 15.88,72.9 | 131.57,39.12 131.7,40.39
  Top 2.54: v131.57,30.86 131.57,39.12 | 131.57,39.12 v131.57,65.66 | 131.57,39.12 D1.C
  Top 3.81: 15.88,72.9 10.16,78.49
  Bottom 0.61: v148.34,24.51 147.19,23.37 135.26,23.37 | CB21.1 110.36,18.8 109.85,18.29 CE20.+ | CB22.1 120.78,18.92 121.41,18.29 CE22.+ | CB17.1 69.85,18.41 69.98,18.29 | CB16.1 59.69,18.54 59.94,18.29 CE17.+ | CB14.1 39.37,18.29 39.24,18.41 | CE16.+ 54.57,18.24 50.46,18.24 50.17,18.54 50.08,18.46 CB15.1 | CB1.1 26.71,81.58 B+3.1 | 92.71,81.66 CB7.1 | 152.65,73.66 153.67,73.66 153.44,73.86 | 141.98,73.86 141.61,73.66 140.34,73.66 139.97,73.86 | 135.26,25.4 D7.A
  Bottom 1.016: 69.85,18.29 CB17.1 | 80.01,18.29 CB18.1 | 92.71,81.66 99.06,81.66 B+6.1
  Bottom 2.184: 99.82,14.73 B+5.1 99.06,19.56 | 27.94,19.56 CE13.+ CE12.+ 10.16,13.97 B+2.1 | 27.94,19.56 CE14.+ | 99.06,19.56 CE19.+ CE18.+ 81.28,19.56 B+7.1 | 99.06,19.56 CE20.+ | CE1.+ CE2.+ CE3.+ | CE7.+ CE8.+ | B+4.1 27.94,19.56 | CE10.+ 132.46,72.9 | 132.46,72.9 137.92,72.9 | 128.14,72.9 132.46,72.9 | v131.57,62.74 v131.57,61.34 | v131.57,65.66 v131.57,64.14
  Bottom 2.54: CE10.+ 128.14,72.9 CE9.+ CE8.+ | CE22.+ 133.35,18.29 135.26,20.95 135.26,23.37 135.26,25.4 135.26,27.18 v131.57,30.86 v131.57,32.26 v131.57,33.66 v131.57,35.05 | 131.57,70.99 v131.57,65.66 v131.57,64.14 v131.57,62.74 v131.57,61.34 | CE15.+ 39.37,18.29 | QEH1.D 152.65,58.42 152.65,73.66 152.65,83.82 | 152.65,83.82 152.65,88.9 QFH1.D | 152.65,83.82 147.32,83.82 147.32,72.77 CE11.+
  Bottom 3.81: B+1.1 QAH1.D 10.16,92.71 27.94,92.71 QAH2.D B+3.1 | 99.06,10.16 B+5.1 | B+7.1 QDH2.D 81.28,4.57 99.06,4.57 99.06,10.16 | B+2.1 QBH1.D 10.16,4.57 27.94,4.57 QBH2.D B+4.1 | B+6.1 QCH1.D 99.06,92.71 81.28,92.71 QCH2.D B+8.1 | 99.06,10.16 QDH1.D | CE14.+ CE15.+ CE16.+ CE17.+ 69.85,18.29 | CE20.+ CE21.+ CE22.+ | CE4.+ CE5.+ CE6.+ | 69.98,18.29 80.01,18.29
  other vias: 11.43,76.45 29.21,74.17 24.13,74.17 30.73,70.99 105.54,74.55 104.14,71.63 11.43,79.25 8.64,79.25 94.36,71.63 99.95,71.63 24.13,72.64 24.13,71.12 29.21,72.52 32.13,70.99 22.73,74.17 22.73,72.64 22.73,71.12 29.21,70.99 10.03,79.25 11.43,77.85 10.03,77.85 10.03,76.45 8.64,76.45 8.64,77.85 79.88,72.77 79.88,71.37 81.28,71.37 82.68,71.37 84.07,71.37 85.47,71.37 86.87,71.37 85.47,72.77 86.87,72.77 85.47,74.17 86.87,74.17 101.35,71.63 99.95,70.23 101.35,70.23 102.74,70.23 102.74,71.63 104.14,70.23 98.55,70.23 97.16,70.23 95.76,70.23 94.36,70.23 105.54,73.15 105.54,71.75 105.54,70.23 99.95,73.02 99.95,74.42
  pour Bottom (isolate 0.61, no thermals): 5.33,19.56 33.02,19.56 33.02,1.27 5.33,1.27
  pour Bottom (isolate 0.61, no thermals): 76.2,19.56 104.14,19.56 104.14,2.03 76.2,2.03
  pour Bottom (isolate 0.61, no thermals): 3.81,95.38 31.75,95.38 31.75,74.17 3.81,74.17
  pour Bottom (isolate 0.61, no thermals): 77.72,95.5 104.14,95.5 104.14,79.5 77.72,79.5
  pour Top (isolate 0.61, no thermals): 5.84,91.19 12.45,91.19 12.45,73.28 5.84,73.28
  pour Top (isolate 0.61, no thermals): 22.86,87.88 34.29,87.88 34.29,71.25 22.86,71.25
  pour Top (isolate 0.61, no thermals): 76.2,94.74 83.19,94.74 83.19,80.26 87.88,76.45 87.88,70.36 76.2,70.36
  pour Top (isolate 0.406, no thermals): 93.98,87.88 105.41,87.88 105.28,70.1 93.85,70.1
  pour Bottom (isolate 0.61, rank 2, no thermals): 1.27,75.44 148.46,75.44 148.46,70.36 1.27,70.36
  pour Top (isolate 0.61, rank 2, no thermals): 78.74,21.46 98.81,21.46 98.93,20.57 98.93,10.16 99.06,10.03 78.74,10.03
  pour Bottom (isolate 0.406, no thermals): 149.86,88.9 149.86,55.88 156.21,55.88 156.21,88.9
B-  (via drill 0.81)
  Top 0.61: B-7.1 112.52,13.46 | 53.85,25.4 56.39,25.4 CE16.- | 53.85,25.4 51.56,25.4 37.34,39.62 21.08,39.62 19.56,38.1 DRV2.5 19.56,33.4 19.81,33.15 19.81,33.14 C5.2 | 53.85,25.4 45.21,34.04 45.21,42.42 U3.2 | CE21.- 115.82,24.89 | v114.3,63.5 112.52,61.72 112.52,59.69 | v119.38,68.58 121.54,70.74 121.54,77.6 121.92,77.98 | 112.52,59.69 DRV3.5 | DRV4.5 113.54,34.42 C9.2 113.54,33.78 114.43,32.89 v114.43,31.24 | v28.57,65.41 25.15,61.98 21.59,61.98 19.38,59.77 DRV1.5 19.3,58.01 19.3,55.37 19.56,55.12 C3.2 | v49.4,68.58 49.4,76.58 v49.53,76.71 | 112.65,57.02 C7.2 112.52,57.02 112.52,59.69 | C10.2 139.7,59.81 139.7,59.82 DRV5.5 139.7,64.26 140.72,65.28 150.24,65.28 | SJ1.1 95.38,43.18 v94.11,41.91 | 150.24,65.28 DRV6.5 150.24,59.18 C12.2 | 132.27,70.93 132.08,71.12 | v134.62,46.99 134.62,54.61 D1.A | 150.24,65.28 151.13,65.28 152.15,66.29 153.8,66.29 154.43,66.93 154.43,69.34 QFL1.S
  Top 2.184: B-7.1 110.49,14.22 110.49,22.1 CE21.- | B-5.1 129.29,14.1 v129.41,23.24 | B-4.1 58.42,13.97 58.42,22.1 | B-2.1 39.37,13.97 39.37,20.83 40.64,22.1 CE15.- | 128.27,53.85 128.14,53.85 v128.27,55.63
  Top 2.54: 58.42,22.1 CE16.- | v128.27,30.86 128.27,53.85 128.27,57.4 | v133.1,76.71 133.1,73.02 132.27,70.93 128.27,66.93 v128.27,57.53 128.27,57.4 | 128.27,57.4 v128.27,55.63
  Top 3.81: 51.31,82.68 51.31,86.11 | QAL2.S B-3.1 69.09,82.68
  Bottom 0.61: U3.2 56.39,34.29 89.92,34.29 92.58,31.75 CE23.- 94.11,32.26 v94.11,41.91 | v114.3,63.5 v119.38,68.58 | v28.57,65.41 30.61,67.44 48.26,67.44 v49.4,68.58 | CB1.2 26.33,77.64 CE2.- | CB2.2 36.49,77.64 CE3.- | C41.2 41.7,77.64 41.66,77.6 41.28,77.98 | 67.52,77.77 CB5.2 | CB8.2 107.7,78.15 107.78,78.15 | CB7.2 92.79,77.68 | CB22.2 125.01,14.69 v125.73,13.97 | v114.43,31.24 121.92,31.24 123.57,29.59 123.57,25.53 v123.19,24.64 | v134.62,46.99 146.05,46.99 151.13,41.91 154.94,41.91 154.94,40.64 QEL1.S
  Bottom 1.016: 82.55,77.98 82.55,78.23 | 92.71,77.72 CB7.2 | 82.55,78.23 CB6.2 | 82.55,78.23 82.55,77.72 | C41.2 41.78,77.98
  Bottom 2.184: CE12.- CE13.- CE14.- CE15.- | CE16.- CE17.- | CE18.- CE19.- CE20.- CE21.- CE22.- 128.27,23.5 | 69.09,77.47 69.09,82.68 B-3.1 | 51.31,77.47 B-1.1 | 122.43,81.79 122.17,81.79 122.17,77.98 CE9.- CE10.- 137.41,77.98 139.7,80.52
  Bottom 2.54: 128.27,23.5 v128.27,30.86 v128.27,32.26 v128.27,33.66 v128.27,35.05 | v133.1,76.71 133.99,76.71 | D1.A 133.48,55.63 v128.27,55.63 v128.27,57.53 v128.27,59.44
  Bottom 3.81: B-1.1 QAL1.S 51.31,92.71 69.09,92.71 QAL2.S | QAL2.S B-3.1 | B-5.1 QDL1.S 129.03,4.57 111.25,4.57 QDL2.S B-7.1 | B-2.1 QBL1.S 40.13,4.57 57.91,4.57 QBL2.S B-4.1 | QCL1.S 140.21,92.71 122.43,92.71 QCL2.S B-8.1 | CE1.- CE2.- CE3.- 41.28,77.98 | 41.78,77.98 CE4.- | QAL2.S 69.09,82.68 | CE5.- CE6.- 82.55,77.98 82.55,77.72 92.71,77.72 97.79,77.72 97.79,77.98 CE7.- CE8.- 107.7,78.15 107.7,78.23
  other vias: 36.58,23.24 42.16,23.24 46.99,22.1 36.58,24.64 39.37,24.64 42.16,24.64 52.07,24.64 57.15,21.84 57.15,24.64 62.74,24.64 62.74,21.84 52.07,22.1 113.41,23.24 118.11,22.1 113.41,24.64 107.82,24.64 129.41,24.64 130.81,24.64 130.81,23.24 107.95,13.97 107.95,11.43 125.73,11.43 38.1,15.24 38.1,12.7 38.1,10.16 125.6,79.25 135.38,76.71 141.22,77.47 54.61,76.71 118.11,24.64 49.53,78.23 49.53,79.76 48.01,78.23 48.01,76.71 46.48,76.71 46.48,78.23 48.01,79.63 54.23,81.79 54.23,80.39 55.63,80.39 55.63,81.79 54.23,78.99 52.83,78.99 57.66,79.76 40.77,24.64 37.97,24.64 57.15,23.24 62.74,23.24 58.55,24.64 59.94,24.64 61.34,24.64 109.22,24.64 110.62,24.64 112.01,24.64 107.82,23.24 107.82,21.84 113.41,21.84 123.19,23.24 123.19,21.84 121.79,24.64 121.79,23.24 121.79,21.84 129.41,21.84 130.81,21.84
  pour Bottom (isolate 0.61, no thermals): 36.83,19.56 68.58,19.56 68.58,1.27 36.83,1.27
  pour Top (isolate 0.61, no thermals): 54.61,24.38 63.5,24.38 63.5,10.16 54.61,10.16
  pour Top (isolate 0.61, no thermals): 36.83,24.38 45.72,24.38 45.72,10.16 36.83,10.16
  pour Bottom (isolate 0.61, no thermals): 107.95,19.56 153.16,19.56 153.16,2.03 107.95,2.03
  pour Top (isolate 0.61, no thermals): 107.95,24.38 115.57,24.38 115.57,8.89 107.95,8.89
  pour Top (isolate 0.61, no thermals): 124.46,24.64 133.35,24.64 133.35,8.89 124.46,8.89
  pour Bottom (isolate 0.61, no thermals): 107.95,94.74 147.57,94.74 147.57,76.2 107.95,76.2
  pour Bottom (isolate 0.61, no thermals): 46.48,95.25 70.1,95.38 70.1,75.44 46.48,75.18
  pour Bottom (isolate 0.61, rank 2, no thermals): 8.38,20.83 132.84,20.83 132.84,25.91 8.38,25.91
  pour Top (isolate 0.61, rank 2, no thermals): 102.87,25.91 133.86,25.91 133.86,17.53 102.87,17.53
  pour Top (isolate 0.61, rank 2, no thermals): 36.07,25.15 64.52,25.15 64.52,17.27 36.07,17.27
  pour Top (isolate 0.61, no thermals): 45.72,84.71 70.99,84.71 70.99,75.56 45.72,75.56
  pour Top (isolate 0.61, rank 3, no thermals): 113.54,90.17 141.35,90.17 141.35,75.44 113.54,75.44
  pour Bottom (isolate 0.406, rank 2, no thermals): 153.67,73.66 153.67,1.27 162.56,1.27 162.56,73.66
BAT1
  Top 0.61: D3.A 143.89,39.12 143.89,11.18 147.19,7.87 X1.1
BAT2
  Bottom 0.61: D4.A 140.21,40.13 141.86,41.78 146.56,41.78 147.32,41.15 147.32,28.32 149.86,25.27 149.86,12.83 151,11.68 X1.2
BATBOTH
  Top 0.61: R10.1 155.32,27.3 155.32,21.46 153.16,19.3 X1.4
BIS  (via drill 0.61)
  Top 0.254: v41.15,44.7 v48.64,52.2 | v116.84,54.99 116.97,55.25 116.97,56.77 117.98,57.79 BATIS.3
  Bottom 0.254: v41.15,44.7 9.4,44.7 7.75,43.05 SV1.14 | v48.64,52.2 48.77,52.32 113.28,52.32 115.95,54.99 v116.84,54.99
GAH
  Top 0.61: RGAH1.1 2.71,75.27 3.05,74.93 10.03,74.93 14.86,70.1 17.4,70.1 | DRV1.12 16.82,66.04 17.4,66.67 17.4,70.1 | RGAH2.1 18.8,81.24 18.8,70.61 17.4,70.1
GAH1  (via drill 0.61)
  Top 0.406: 91.44,67.56 76.2,67.56 73.91,69.85 73.91,82.17 RGCH2.1 | 91.44,67.56 91.44,82.17 RGCH1.1 | v110.11,63.75 109.98,65.79 DRV3.12 | 91.44,67.56 v103.89,67.56
  Bottom 0.406: v103.89,67.56 107.44,67.56 110.11,64.9 v110.11,63.75
GAL
  Top 0.61: RGAL1.1 41.74,80.86 39.62,78.74 39.62,72.77 34.29,67.44 | 34.29,67.44 27.56,60.71 21.84,60.71 20.7,59.56 20.7,58.29 DRV1.6 | RGAL2.1 59.44,81.79 59.44,76.41 59.4,70.06 56.77,67.44 34.29,67.44
GAL1
  Top 0.61: RGCL2.1 112.9,81.66 112.9,73.41 116.33,69.98 116.33,67.44 | 116.33,67.44 116.33,62.48 115.7,61.85 114.68,61.85 113.79,60.96 DRV3.6 | RGCL1.1 130.56,81.03 130.56,72.14 129.03,70.61 123.83,70.61 120.65,67.44 116.33,67.44
GBH
  Top 0.406: 20.57,20.07 15.24,14.22 RGBH1.1 | 20.57,20.07 27.3,20.07 27.3,19.43 31.37,14.86 RGBH2.1 | DRV2.12 16.76,41.02 16.51,40.77 16.51,40.64 14.73,38.86 13.46,38.86 13.46,27.18 20.57,20.07
GBH1  (via drill 0.61)
  Top 0.406: 101.35,25.15 92.96,25.15 90.42,22.61 90.42,20.32 87.88,17.78 87.88,17.14 85.85,14.61 RGDH2.1 | 101.35,25.15 101.35,16.89 102.87,14.86 RGDH1.1 | v105.54,30.48 105.54,40.13 109.35,40.13 111,41.78 DRV4.12 | v105.54,28.32 104.77,28.32 101.6,25.15 101.35,25.15
  Bottom 0.406: v105.54,28.32 v105.54,30.48
GBL  (via drill 0.81)
  Top 0.61: RGBL1.1 49.4,14.86 48.26,16.04 48.26,26.92 47.88,27.3 | 47.88,27.3 36.45,38.61 21.84,38.61 20.83,37.59 DRV2.6 | RGBL2.1 67.82,13.97 67.82,25.4 66.29,26.92 v54.61,26.92 | 47.88,27.3 v47.5,26.92
  Bottom 0.61: v47.5,26.92 v54.61,26.92
GBL1
  Top 0.61: RGDL2.1 120.65,14.48 119.63,16 119.63,26.92 | 119.63,26.92 119.63,36.83 117.98,38.48 115.19,38.48 114.81,38.1 DRV4.6 | RGDL1.1 138.3,13.72 138.3,15.37 135.13,19.05 135.13,25.91 134.11,26.92 119.63,26.92
GND  (via drill 0.61, 0.61 pad 0.81, 0.81, 0.81 pad 0.81)
  Top 0.254: R15.1 111,29.97 110.74,29.97 110.74,35.05 111,35.56 DRV4.3 | R13.1 17.4,29.08 17.4,34.42 17.02,34.8 DRV2.3 | C14.2 | SV1.26 SV1.25 4.95,28.07 5.71,28.83 5.71,41.4 5.65,41.47 | 5.65,41.47 5.71,41.53 5.71,46.36 4.95,47.12 SV1.9 | 5.65,41.47 4.95,40.77 SV1.15 | v11.05,39.37 R6.1 | R4.16 v4.57,64.14
  Top 0.406: R1.1 135.8,60.11 137.16,61.47 DRV5.3 137.16,62.23 | R16.1 145.33,59.73 146.18,60.58 146.94,60.58 147.7,61.34 DRV6.3 147.7,62.36
  Top 0.61: 116.97,49.02 117.6,49.02 120.14,51.56 120.14,59.18 119,60.33 BATIS.4 | 116.97,49.02 114.3,49.02 111.38,51.94 R14.1 110.11,52.58 109.47,52.58 109.47,58.17 109.98,58.67 DRV3.3 109.98,60.71 105.41,65.28 71.88,65.28 71.88,56.13 RMIS.4 72.01,55.88 70.48,54.36 69.47,54.36 65.91,50.8 65.91,42.16 67.31,40.77 U3.4 | DRV4.3 111,37.85 114.43,40.89 116.97,40.89 116.97,49.02 | v17.02,37.85 DRV2.3 | 16.64,50.67 16.64,56.26 v17.14,56.26 | 16.64,50.67 v16.64,47.24 v18.16,48.77 | 16.64,50.67 R12.1 | v32.64,53.34 32.64,54.1 31.75,54.99 LMIS.4 | 147.83,36.32 147.83,38.74 148.72,39.62 D5.A | v146.05,36.32 147.83,36.32 | 89.92,45.34 SJ1.2 | 147.83,36.32 152.91,31.24 152.91,28.96 152.53,28.57 X1.5 | v17.02,60.33 16.84,60.33 DRV1.3 16.84,56.46 | v26.8,61.72 v30.35,65.28 | R1.1 135.8,58.51 v137.16,57.15 139.7,54.61 139.95,54.61 v140.34,54.23 | v150.62,55.25 147.96,57.91 146.05,57.91 145.29,58.67 145.54,59.05 145.42,59.18 R16.1 | v121.79,28.07 122.05,27.81 137.8,27.81 141.61,31.62 141.61,34.67 | 141.61,34.67 141.61,42.16 147.7,48.26 147.7,51.56 144.78,54.48 v143.13,54.48 | v99.06,59.69 v101.6,59.69 | v92.71,51.31 v92.71,53.34 | v54.61,38.1 v54.61,34.29 v54.61,31.24 | v11.43,55.88 v11.43,60.96 | 141.61,34.67 v141.99,34.67
  Top 1.27: 89.92,43.69 88.77,43.69 84.96,39.88 U3.4 | 89.92,43.69 C14.2 | 89.92,43.69 C13.1 | C13.1 | C13.1 89.92,45.34
  Bottom 0.254: SV1.15 4.7,40.13 4.95,40.01 | 5.38,48.81 5.21,48.64 4.95,48.39 SV1.9 | 11.43,38.86 11.43,39.37 v11.05,39.37
  Bottom 0.61: v17.02,37.85 16,38.86 11.43,38.86 6.48,38.86 5.33,40.01 4.95,40.01 | v17.14,56.26 18.67,57.79 31.37,57.79 31.37,56.52 LMIS.4 | 5.21,48.13 6.1,49.02 14.22,49.02 14.48,48.77 v16.64,47.24 | v32.64,53.34 32.77,53.21 63.75,53.21 | v141.99,34.67 v146.05,36.32 | v150.62,55.25 149.61,54.23 v140.34,54.23 140.46,54.48 v143.13,54.48 | SV1.26 7.11,28.57 65.28,28.57 67.06,26.8 121.16,26.8 121.79,27.43 v121.79,28.07 | 12.45,57.66 12.57,57.79
  other vias: 68.33,53.21 65.91,48.13 83.82,65.28 109.47,57.4 114.17,40.64 115.57,49.02 116.97,44.58 139.7,34.67 139.7,32.51 65.91,43.18
  pour Bottom: 0.76,68.71 0.76,28.19 147.83,28.19 147.83,68.71
  pour Top (isolate 0.406, rank 2, no thermals): 137.16,38.1 137.16,27.94 147.32,27.94 147.32,38.1
INA
  Top 0.254: SV1.1 4.95,58.55 5.97,59.56 5.97,67.94 R4.4 10.41,67.69 12.83,65.28 12.83,54.61 13.21,54.23 13.21,53.59 15.24,53.59 15.37,53.72 15.37,56.39 14.61,57.15 DRV1.1
INB  (via drill 0.61)
  Top 0.254: v7.37,64.77 9.02,66.42 R4.3 | v3.3,62.99 3.17,62.87 3.17,57.02 4.19,56.01 SV1.3 | v9.27,27.18 8.76,26.67 8.76,26.04 8.51,25.78 1.14,25.78 1.14,50.93 v2.03,51.82 | v14.48,27.56 DRV2.1
  Bottom 0.254: v7.37,64.77 5.59,62.99 v3.3,62.99 | v14.48,27.56 14.1,27.18 v9.27,27.18 | v2.03,51.82 2.67,52.45 2.67,54.86 4.06,54.86 SV1.3
INC  (via drill 0.61)
  Top 0.254: v4.06,59.44 5.46,60.83 5.46,68.96 9.02,68.96 R4.5 | v2.29,58.42 2.67,58.04 2.67,54.99 4.19,53.47 SV1.5 | v72.9,64.14 104.9,64.14 107.19,61.85 107.19,60.58 DRV3.1 | v55.75,66.42 34.29,66.42 27.56,59.69 v22.73,59.69
  Bottom 0.254: v2.29,58.42 3.05,59.18 4.06,59.18 v4.06,59.44 4.32,59.82 8,59.82 8.51,59.31 22.73,59.31 v22.73,59.69 | v72.9,64.14 70.61,66.42 v55.75,66.42
IND  (via drill 0.61)
  Top 0.254: v108.46,38.35 DRV4.1 | R4.7 9.02,72.01 5.71,72.01 3.94,73.79 1.4,73.79 1.4,53.72 4.19,50.93 SV1.7
  Bottom 0.254: v108.46,38.35 101.98,44.83 55.25,44.83 54.86,44.45 52.07,44.45 51.69,44.83 42.55,44.83 32.38,34.67 24.89,34.67 23.11,36.45 6.6,36.45 5.71,37.34 5.71,38.1 4.83,38.99 4.06,38.99 3.43,39.62 3.43,49.4 3.94,49.91 SV1.7
INE  (via drill 0.61)
  Top 0.254: 134.62,62.23 DRV5.1 134.37,63.12 133.86,63.63 133.86,70.1 135.13,71.37 v135.13,74.93 | v5.46,69.85 5.46,70.99 3.68,72.77 R4.9 | v6.86,67.06 6.48,66.67 6.48,58.93 5.84,58.29 v5.84,56.26 | v2.54,30.23 v2.54,48.77 | v109.47,75.31 109.35,75.18 109.35,71.75 103.76,66.17 58.04,66.17 58.04,62.87 54.99,59.82 30.99,59.82 v30.99,60.07
  Bottom 0.254: 6.79,68.52 6.86,68.45 v6.86,67.06 | 6.79,68.52 v5.46,69.85 | v5.84,56.26 5.84,53.98 3.3,53.98 3.3,50.42 2.92,50.04 2.92,49.15 v2.54,48.77 | v2.54,30.23 2.67,30.1 3.94,30.1 SV1.23 | v135.13,74.93 135.13,75.06 132.21,75.06 132.21,75.31 v109.47,75.31 | v30.99,60.07 28.32,62.74 18.54,62.74 12.7,68.58 6.86,68.58 6.79,68.52
INF  (via drill 0.61)
  Top 0.254: v144.65,64.14 144.65,63.37 144.91,63.12 DRV6.1 | v139.06,57.02 142.49,53.59 144.65,53.59 147.07,51.18 147.07,48.64 140.97,42.55 140.97,32 137.41,28.45 123.06,28.45 122.43,29.08 v120.78,29.08 | v4.57,65.66 4.57,70.61 3.68,71.5 R4.10 | v2.03,50.55 3.43,49.15 3.43,26.92 4.06,26.29 8.26,26.29 8.26,28.57 7.49,29.34 SV1.24
  Bottom 0.254: v144.65,64.14 140.97,67.82 136.4,67.82 135.38,66.8 135.38,59.05 137.16,59.05 v139.06,57.02 | v120.78,29.08 119.13,27.43 105.16,27.43 104.01,28.57 104.01,29.34 96.9,29.34 95.76,28.19 67.18,28.19 65.79,29.59 7.75,29.59 SV1.24 | v4.57,65.66 1.14,62.23 1.14,50.55 v2.03,50.55
LMIS  (via drill 0.61)
  Top 0.254: v53.59,45.59 v65.15,57.15
  Bottom 0.254: v53.59,45.59 7.75,45.59 SV1.12 | v65.15,57.15 65.28,57.28 73.15,57.28 74.17,56.26 RMIS.3
MA1  (via drill 0.81)
  Top 0.61: 105.41,80.52 104.77,80.14 108.46,80.14 110.49,78.1 110.49,71.12 111.51,70.1 111.51,68.45 | 111.25,65.79 DRV3.11 111.25,68.2 111.51,68.45 | v90.3,68.58 89.66,69.21 89.66,79.25 87.25,81.66 MC2.1 | 111.51,68.45 C6.2
  Top 1.016: 104.65,81.79 104.14,81.79 105.41,80.52
  Top 3.81: QCH1.S 104.65,81.79 MC1.1 | 104.65,92.71 86.87,92.71 134.62,92.71 116.84,92.71 | MC2.1 QCH2.S | QCL1.D MC3.1 | QCL2.D MC4.1
  Top 5.08: 104.65,92.71 QCH1.S | QCH2.S 86.87,92.71 | 134.62,92.71 QCL1.D | 116.84,92.71 QCL2.D
  Bottom 0.61: R5.1 100.33,61.6 93.34,68.58 v90.3,68.58
  pour Top (isolate 0.61, rank 2, no thermals): 83.57,95.38 138.43,95.38 138.43,87.88 83.57,87.88
MA2
  Top 0.61: DRV1.11 18.16,64.16 18.16,65.91 18.67,66.67 | R3.1 26.29,56.9 33.91,64.52 55.37,64.52 63.5,72.64 MA4.1 | 18.29,67.82 C2.2 18.67,66.67 | 18.67,66.67 23.11,66.67 25.15,68.71 33.66,68.71 34.93,69.98 34.93,81.28 33.4,82.8 MA2.1
  Top 3.81: 63.5,92.71 45.72,92.71 33.53,92.71 15.75,92.71 | MA2.1 QAH2.S | QAH1.S MA1.1 | QAL1.D MA3.1 | QAL2.D MA4.1
  Top 5.08: QAH2.S 33.53,92.71 | 45.72,92.71 QAL1.D | 63.5,92.71 QAL2.D | 15.75,92.71 QAH1.S
  pour Top (isolate 0.61, rank 2, no thermals): 14.22,95.88 67.18,95.88 67.18,86.87 14.22,86.87
MB1
  Top 0.61: DRV4.11 112.27,42.67 | C8.2 100.33,26.16 84.07,26.16 82.04,24.13 82.04,20.95 75.69,14.61 MD2.1 75.56,13.21 75.82,13.46 75.82,16 81.15,21.34 81.15,24.51 83.69,27.05 97.03,27.05 99.44,29.46 106.17,29.46 106.68,29.97 106.68,39.37 109.85,39.37 112.27,41.78 DRV4.11 | 116.84,9.91 QDL2.D | C11.2 112.52,45.72 112.27,45.47 DRV4.11
  Top 3.81: QDH1.S MD1.1 | QDH2.S MD2.1 | QDL1.D MD3.1 | 75.69,4.57 93.34,4.57 | 93.34,4.57 93.47,4.57 | 93.34,4.57 116.84,4.57 134.62,4.57 | MD4.1 116.84,10.16
  Top 5.08: 75.69,4.57 QDH2.S | 93.47,4.57 QDH1.S | 116.84,4.57 116.84,9.91 | 134.62,4.57 QDL1.D
  Bottom 0.813: MD1.1 93.98,14.73
  Bottom 3.81: MD2.1 75.69,10.16 | MD1.1 93.47,10.16 | 116.84,9.91 QDL2.D MD4.1 | MD3.1 134.62,10.16
  pour Top (isolate 0.61, rank 2, no thermals): 73.66,1.27 137.16,1.27 137.16,7.87 73.66,7.87
MB2  (via drill 0.81)
  Top 0.61: C1.2 29.34,20.19 33.4,16.13 35.05,16.13 36.32,14.86 36.32,4.57 | v17.91,40.01 17.91,40.89 18.03,41.02 DRV2.11 18.29,44.96 18.54,45.21 C4.2 | v13.59,40.01 12.45,38.86 12.45,25.02 11.56,24.13 11.56,17.02 12.19,16.38 12.19,8.38 12.91,7.66
  Top 3.81: 4.57,4.57 22.35,4.57 36.32,4.57 45.72,4.57 63.5,4.57
  Top 5.08: 4.57,4.57 MB1.1 | 22.35,4.57 MB2.1 | 45.72,4.57 MB3.1 | 63.5,4.57 MB4.1
  Bottom 0.61: v13.59,40.01 v17.91,40.01
  Bottom 3.81: MB1.1 QBH1.S | 22.35,9.91 QBH2.S MB2.1 | 45.72,9.91 QBL1.D MB3.1 | 63.5,9.91 QBL2.D MB4.1
  pour Top (isolate 0.61, rank 2, no thermals): 4.06,1.27 66.04,1.27 66.04,8.13 4.06,8.13
ME  (via drill 0.61)
  Top 0.61: 147.19,73.66 C16.2 | 147.19,73.66 143.51,69.98 138.43,69.98 DRV5.11 138.43,66.8 v139.19,66.04 | 147.19,73.66 C16.2 | v147.45,56.77 149.99,54.23 151.26,54.23 153.42,56.39 153.42,60.83 155.19,62.61 157.35,62.61 159,60.96 159,58.42 156.46,55.88 QEH1.S
  Top 1.422: QEL1.D 160.02,43.18 160.02,50.8 156.21,50.8
  Top 2.54: ME1.1 156.21,50.8 QEH1.S
  Bottom 0.61: v139.19,66.04 139.19,65.02 v147.45,56.77
  pour Top (isolate 0.406, no thermals): 162.56,39.37 162.56,58.42 154.94,58.42 154.94,39.37
MF
  Top 0.61: DRV6.11 148.97,69.34 152.4,72.77 152.53,73.54 | 152.53,73.54 C15.2 | 152.53,73.54 153.03,73.54 153.03,80.26 155.96,80.26 MF1.1
  Top 1.422: QFL1.D 160.66,73.66 160.66,81.28 MF1.1
  Top 2.54: 156.21,81.15 MF1.1 156.21,81.28 QFH1.S
  pour Top (isolate 0.406, no thermals): 156.21,88.9 156.21,71.12 162.56,71.12 162.56,88.9
N$1
  Top 0.61: R11.2 138.3,32.77 138.3,42.93 D2.C
N$2
  Bottom 0.61: R3.2 29.34,37.47 C1.1
N$3
  Top 0.254: R12.2 18.03,57.15 DRV1.4
N$4
  Top 0.61: C8.1 R5.2
N$5
  Top 0.254: R14.2 111.25,54.74 DRV3.4
N$6
  Top 0.254: R15.2 112.27,32 DRV4.4
N$7
  Top 0.61: R9.1 154.69,34.93 156.46,33.15 R10.2
N$8
  Top 0.61: D3.C D4.C 136.78,47.37 136.78,35.81 R9.2
  Bottom 0.406: D7.C 144.53,25.4 135.89,34.16 R9.2
N$9
  Top 0.254: R13.2 18.29,30.61 DRV2.4
N$10
  Top 0.406: RGEH1.2 154.18,52.96 154.18,59.65 QEH1.G
N$11
  Top 0.406: RGEL1.2 154.05,48.26 154.31,48.01 156.21,46.14 QEL1.G
N$12
  Top 0.61: DRV5.6 140.97,63.88 141.48,64.39 143.26,64.39 143.64,64.01 143.64,60.83 143.89,60.58 143.89,57.15 149.35,51.69 150.62,51.44 RGEL1.1
N$13
  Top 0.406: RGFH1.2 QFH1.G
N$15
  Top 0.61: RGFL1.1 152.69,65.19 151.51,64.01 DRV6.6
N$16  (via drill 0.61, 0.61 pad 0.81)
  Top 0.61: RGEH1.1 151.51,52.71 149.99,52.71 v146.05,56.64 | v136.78,66.04 137.16,66.42 DRV5.12
  Bottom 0.61: v146.05,56.64 145.67,57.15 v136.78,66.04
N$17
  Top 0.61: DRV5.13 135.89,70.87 141.86,70.87 144.65,73.66 | 144.65,73.66 C16.1 | D6.1 144.65,74.65 144.65,73.66
N$20
  Top 0.406: RGFL1.2 157.99,68.83 158.75,68.83 158.75,72.39 154.05,72.39 154.05,75.18 154.56,76.2 QFL1.G
N$21
  Top 0.406: DRV6.12 147.7,69.47 151,72.77 151,76.71 151.89,77.6 151.89,89.79 151.51,90.17 RGFH1.1
N$22
  Top 0.61: DRV6.13 146.43,69.98 149.73,73.28 149.73,73.53 149.73,73.54 C15.1 149.61,77.57 D6.2
N$24
  Top 0.406: R1.2 137.5,60.16 138.43,61.09 DRV5.4 138.43,62.23
N$25
  Top 0.406: R16.2 147.19,59.56 148.97,61.34 DRV6.4 148.97,62.23
PWRUP
  Top 0.61: D5.C 149.1,43.82 D2.A 144.91,39.37 144.91,18.29 147.7,15.49 X1.3
  Bottom 0.61: U3.1 48.51,37.34 53.34,32.51 87.76,32.51 CE23.+ 90.93,29.34 95.12,29.34 99.19,33.4 123.06,33.4 126.87,37.21 132.21,37.21 133.1,36.32 141.86,36.32 D2.A
Q1G
  Top 1.016: RGAH1.2 4.57,82.68 QAH1.G
Q1G1
  Top 1.016: RGCH1.2 93.6,82.42 QCH1.G
Q2G
  Top 1.016: RGAH2.2 21.72,82.42 21.72,85.98 QAH2.G
Q2G1
  Top 1.016: RGCH2.2 75.69,82.8 QCH2.G
Q3G
  Top 1.016: RGAL1.2 40.13,82.55 QAL1.G
Q3G1
  Top 1.016: RGCL1.2 129.03,82.55 QCL1.G
Q4G
  Top 1.016: RGAL2.2 57.91,82.3 QAL2.G
Q4G1
  Top 1.016: RGCL2.2 111.25,82.42 QCL2.G
Q5G
  Top 1.016: RGBH1.2 16.89,13.59 16.89,10.03 QBH1.G
Q5G1
  Top 1.016: RGDH1.2 104.65,13.46 QDH1.G
Q6G
  Top 1.016: RGBH2.2 33.53,13.72 QBH2.G 33.53,9.91
Q6G1
  Top 1.016: RGDH2.2 87.38,13.46 87.38,10.03 QDH2.G
Q7G
  Top 1.016: RGBL1.2 51.31,13.84 QBL1.G
Q7G1
  Top 1.016: RGDL1.2 140.21,13.46 QDL1.G
Q8G
  Top 1.016: RGBL2.2 69.09,13.21 QBL2.G
Q8G1
  Top 1.016: RGDL2.2 122.43,13.33 QDL2.G
RMIS  (via drill 0.61)
  Top 0.254: v23.24,43.82 26.29,43.82 33.53,51.05 33.53,54.99 LMIS.3
  Bottom 0.254: v23.24,43.82 20.95,41.53 5.97,41.53 5.21,42.29 SV1.13
VB1
  Top 0.61: C2.1 15.49,67.69 15.49,66.8 15.49,65.15 DRV1.13 15.62,63.12 15.37,63.12 13.46,61.21 13.46,54.99 13.84,54.61 14.35,54.61 | 14.35,54.61 14.31,54.57 D11.2 14.35,54.59 14.35,54.61
VB2
  Top 0.61: DRV2.13 15.75,44.32 | 15.75,44.32 15.75,44.83 | 15.75,44.32 C4.1 14.22,46.86 14.22,52.07 14.31,52.66 D11.1
VB3  (via drill 0.61)
  Top 0.61: v108.71,63.88 108.71,65.79 | 108.71,65.79 DRV3.13 | C6.1 108.71,65.79 | v106.3,61.47 106.3,56.39 106.51,56.18 D10.2
  Bottom 0.61: v106.3,61.47 v108.71,63.88
VB4
  Top 0.61: DRV4.13 109.73,45.72 C11.1 108.46,47.24 108.46,52.32 107.12,53.66 D10.1
VBATSENSE
  Top 0.254: R2.1 R6.2 10.92,32.38 8.64,32.38 8.64,38.1 7.49,39.24 SV1.16
(copper drawn outside any net)
  shapes: Top area x1

### Text on the board
tPlace: Controller v9 | MA* thru hole | MC* thru hole | BATIS | LMIS | RMIS | B+ thru hole | GND | BATALL | PWRUP | BAT2 | BAT1